# Altium project RIO_rev1.PrjPcb
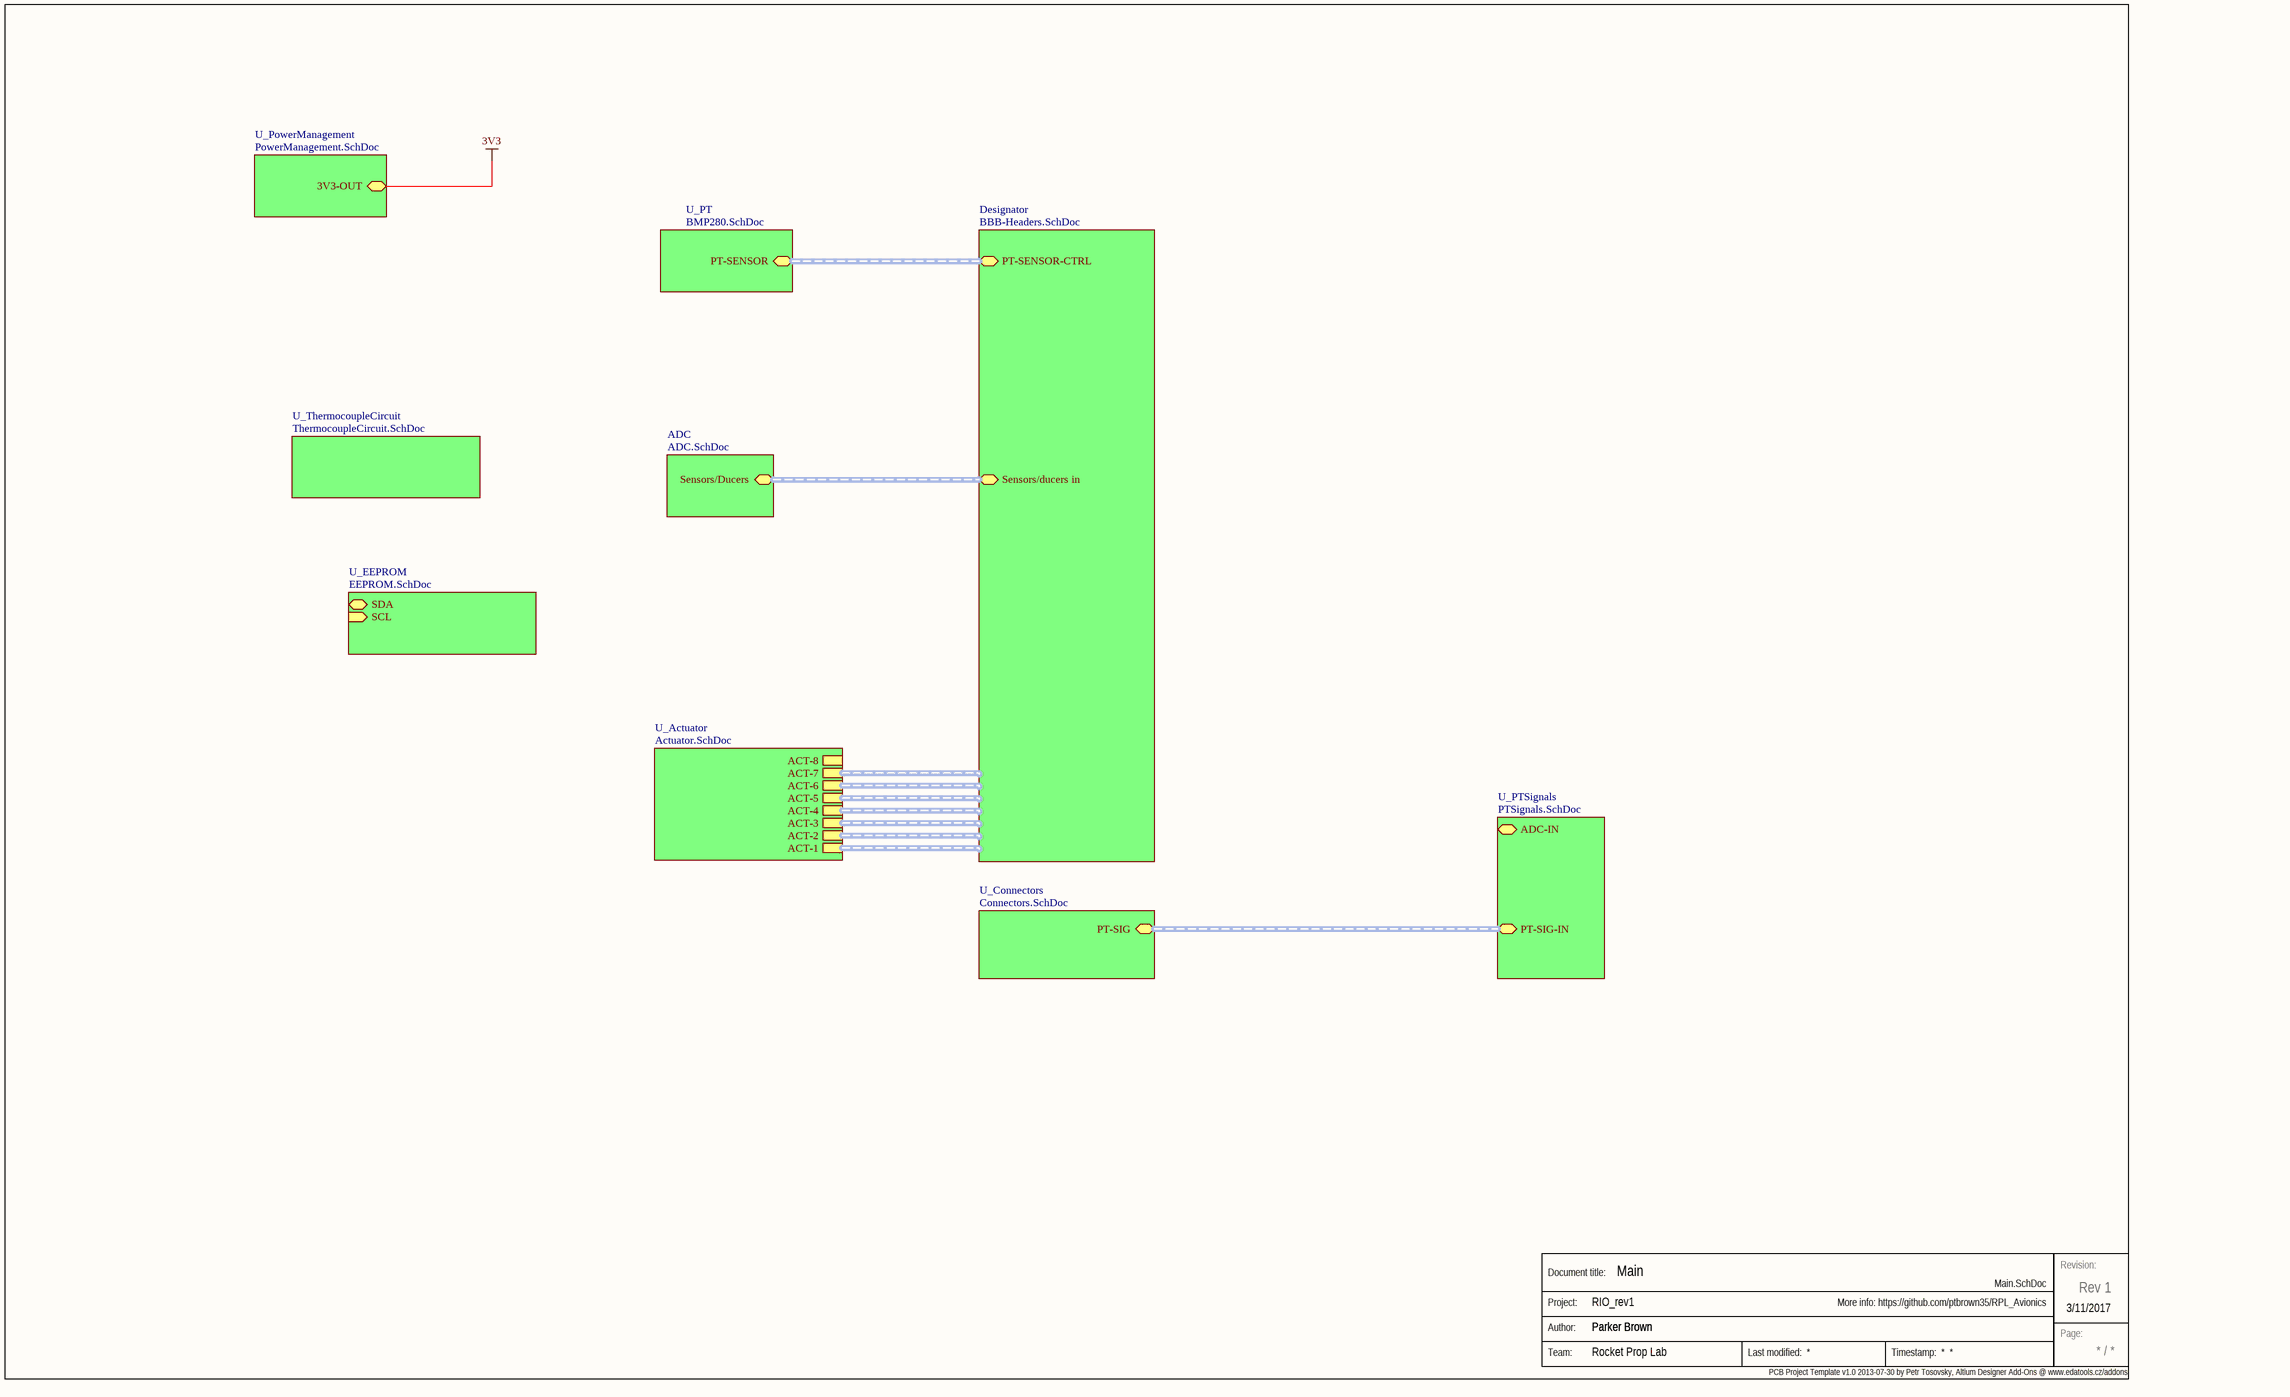
[diagram p0: Main.SchDoc]
GlobalProjectLink: https://github.com/ptbrown35/RPL_Avionics; GlobalProjectName: RIO_rev1; GlobalProjectRevision: Rev 1; GlobalProjectTeam: Rocket Prop Lab; GlobalRevisionDate: 3/11/2017
10 sheets, 85 parts. Net scope: hierarchical (ports join the sheet entries above them; power ports are global).
Board file: RIO_rev1.PcbDoc
Sheets:
  Main.SchDoc
    Designator = BBB-Headers.SchDoc
    U_Connectors = Connectors.SchDoc
      J-PT1 = AnalogConnectors.SchDoc
      J-PT2 = AnalogConnectors.SchDoc
      J-PT3 = AnalogConnectors.SchDoc
      J-PT4 = AnalogConnectors.SchDoc
      J-PT5 = AnalogConnectors.SchDoc
      J-PT6 = AnalogConnectors.SchDoc
      J-PT7 = AnalogConnectors.SchDoc
      J-PT8 = AnalogConnectors.SchDoc
    U_PowerManagement = PowerManagement.SchDoc
    U_PT = BMP280.SchDoc
    U_PTSignals = PTSignals.SchDoc
      U_ADC1 = ADC.SchDoc
      U_ADC2 = ADC.SchDoc
      U_ADC3 = ADC.SchDoc
      U_ADC4 = ADC.SchDoc
      U_ADC5 = ADC.SchDoc
      U_ADC6 = ADC.SchDoc
      U_ADC7 = ADC.SchDoc
      U_ADC8 = ADC.SchDoc
    U_Actuator = Actuator.SchDoc
    ADC = ADC.SchDoc
    U_EEPROM = EEPROM.SchDoc

## Sheet Main.SchDoc: Main
size Tabloid; Author: Parker Brown

### Parts
(Parts that share a designator on the sheet are numbered #1, #2 ... from top to bottom, then left to right.)
Stamp#1  Stamp  (value not drawn)  (graphical)

### Sub-sheets
ADC = ADC.SchDoc: Sensors/Ducers (harness ADC to micro)
Designator = BBB-Headers.SchDoc: PT-SENSOR-CTRL (harness PT-SENSOR), Sensors/ducers in (harness ADC)
U_Actuator = Actuator.SchDoc: ACT-8 (harness ACT), ACT-7 (harness ACT), ACT-6 (harness ACT), ACT-5 (harness ACT), ACT-4 (harness ACT), ACT-3 (harness ACT), ACT-2 (harness ACT), ACT-1 (harness ACT)
U_Connectors = Connectors.SchDoc: PT-SIG (harness PT-SIGNALS)
U_EEPROM = EEPROM.SchDoc: SDA (bidir), SCL (in)
U_PowerManagement = PowerManagement.SchDoc: 3V3-OUT
U_PT = BMP280.SchDoc: PT-SENSOR (harness PT-SENSOR)
U_PTSignals = PTSignals.SchDoc: PT-SIG-IN (harness PT-SIGNALS), ADC-IN (harness ADC)
U_ThermocoupleCircuit = ThermocoupleCircuit.SchDoc (file not in this document): no entries

### Buses and harness runs
harness sheet ADC/Sensors/Ducers = sheet Designator/Sensors/ducers in
harness sheet Designator/PT-SENSOR-CTRL = sheet U_PT/PT-SENSOR
harness sheet U_Connectors/PT-SIG = sheet U_PTSignals/PT-SIG-IN

### Notes on the sheet
- PCB Project Template v1.0 2013-07-30 by Petr Tosovsky, Altium Designer Add-Ons @ www.edatools.cz/addons <http://www.edatools.cz/addons>
- Labels drawn without touching a wire or pin: 3V3
- (in symbol Stamp) Revision:; Document title:; Project:; Author:; Page:; Team:

## Sheet BBB-Headers.SchDoc: Set in Document Options » Parameters » Title
size Tabloid; Author: Set in Document Options » Parameters » Author + Contact info
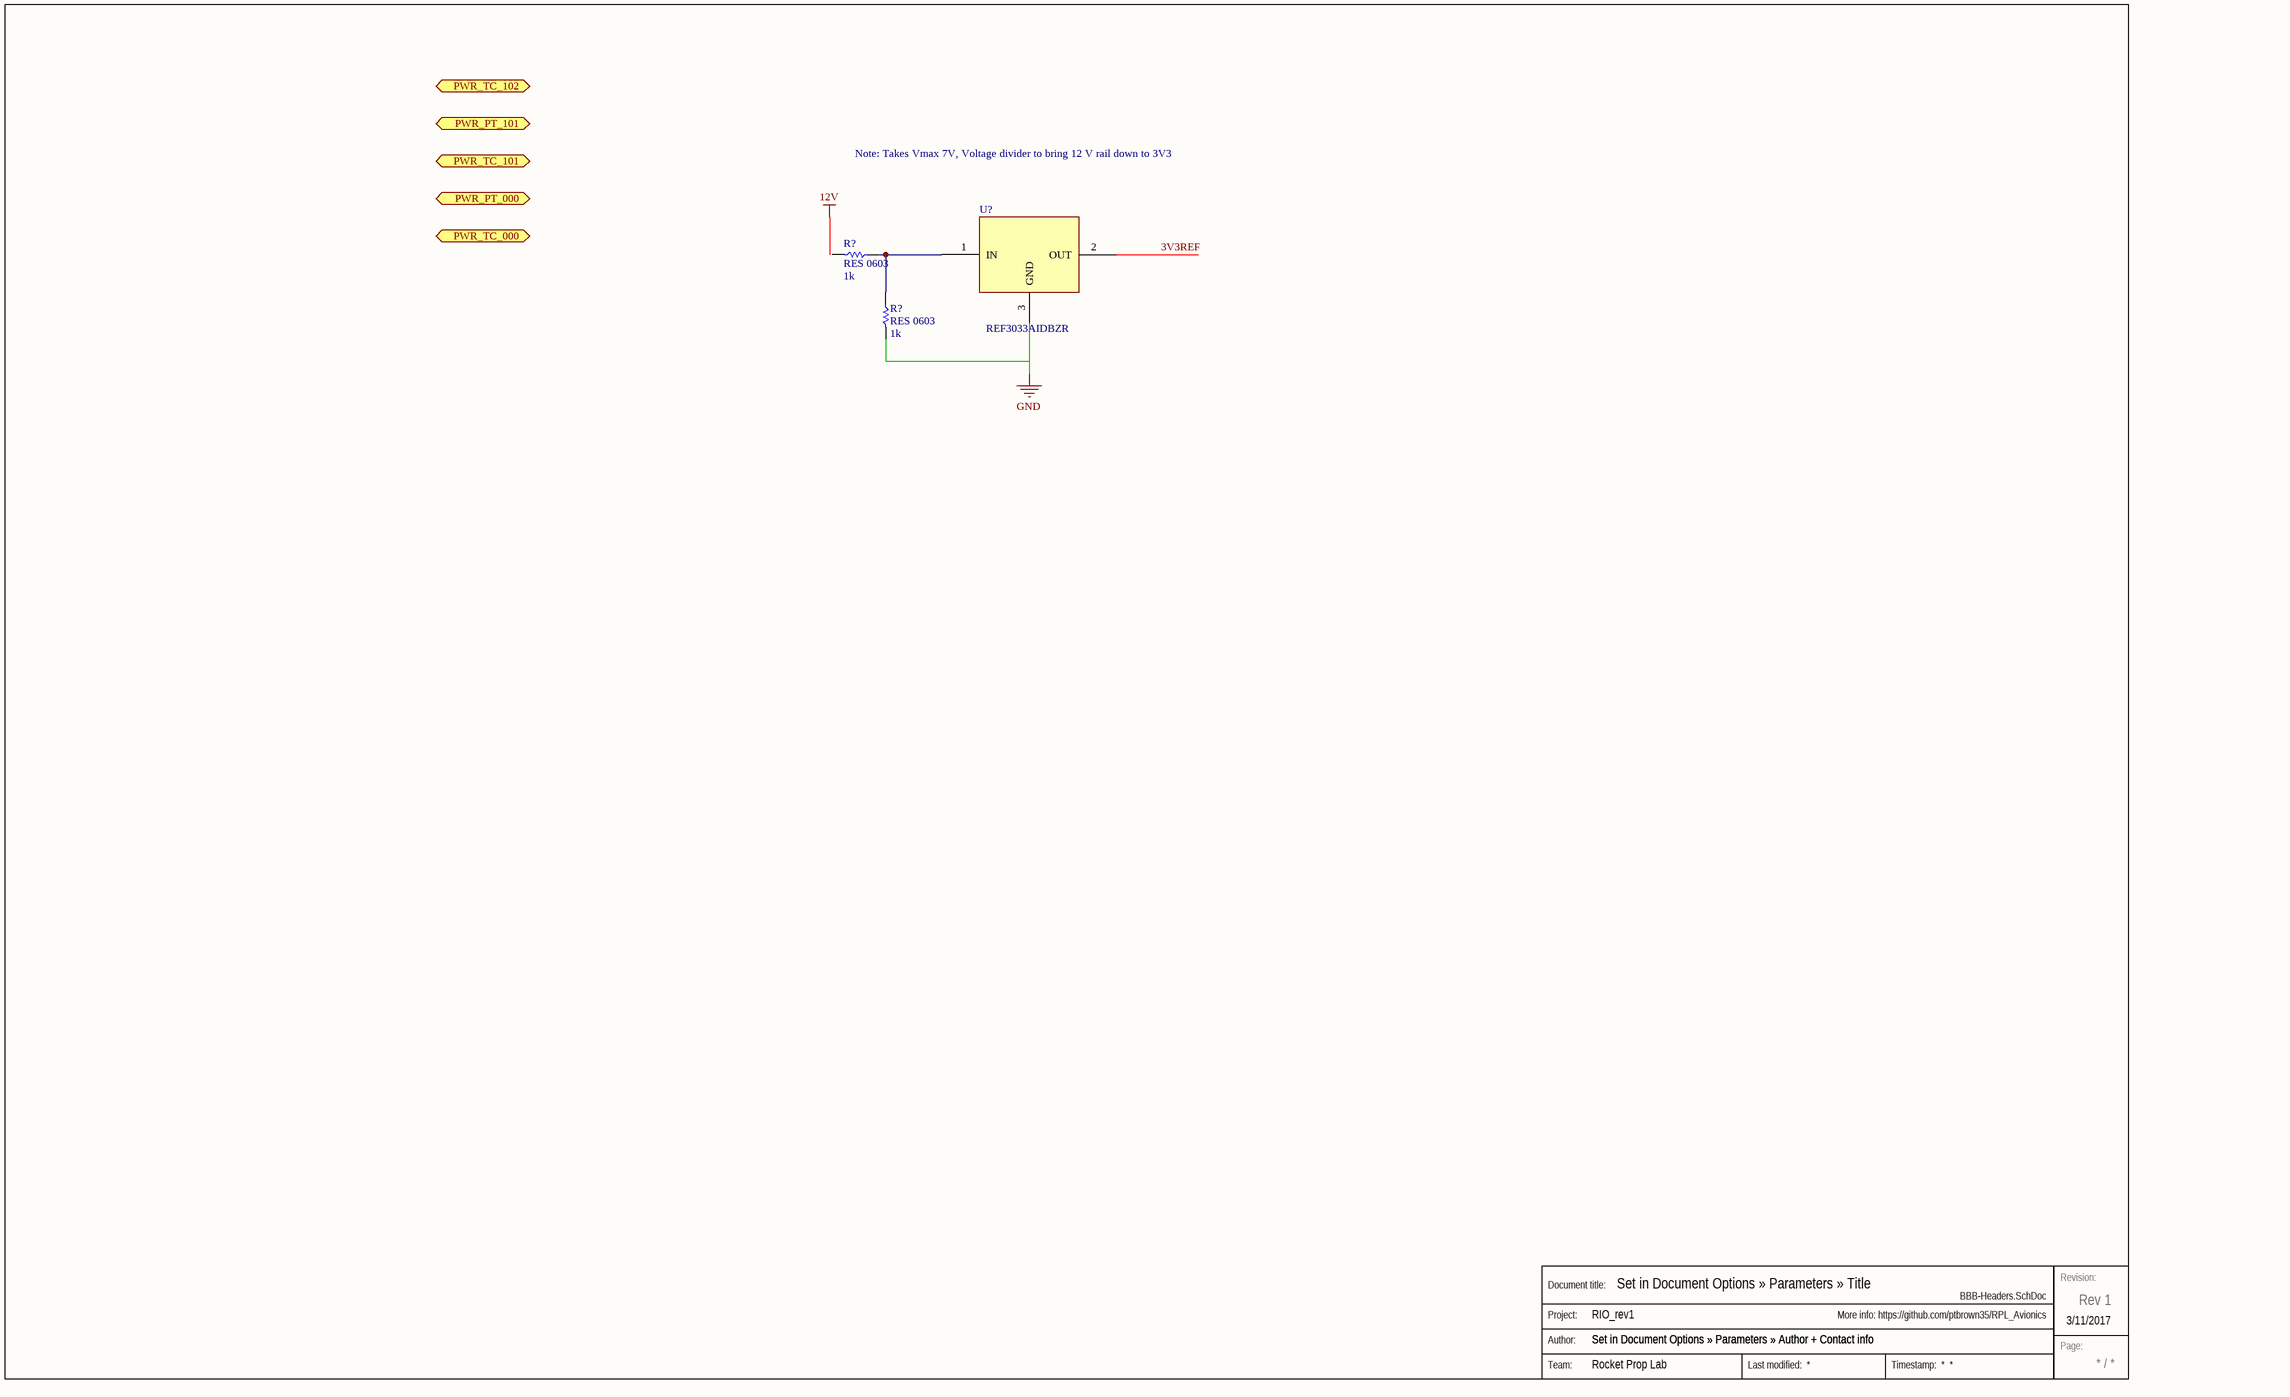
[diagram p1: BBB-Headers.SchDoc]

### Parts
(Parts that share a designator on the sheet are numbered #1, #2 ... from top to bottom, then left to right.)
R?#1  RES 0603  Value (Ohms): 1k  [RES 0603]
R?#2  RES 0603  Value (Ohms): 1k  [RES 0603]
Stamp#2  Stamp  (value not drawn)  (graphical)
U?#1  REF3033AIDBZR  [SOT95P282X145-3N]

### Ports
PWR_PT_000, PWR_PT_101, PWR_TC_000, PWR_TC_101, PWR_TC_102

### Nets
NetR?#1_2: R?#1.2 R?#2.2 U?#1.1(IN)

Not connected (* = marked no-connect by the designer): R?#1 1; R?#2 1; U?#1 2(OUT) 3(GND)

### Buses and harness runs
bus 3V3REF

### Notes on the sheet
- Note: Takes Vmax 7V, Voltage divider to bring 12 V rail down to 3V3
- Labels drawn without touching a wire or pin: 12V, GND
- (in symbol Stamp) Revision:; Document title:; Project:; Author:; Page:; Team:

### Library data of the parts
U?#1 = REF3033AIDBZR: Manufacturer: Texas Instrument; Digikey Link: https://www.digikey.com/product-detail/en/texas-instruments/REF3033AIDBZR/296-26324-1-ND/2254967; Digikey P/N: 296-26324-1-ND; Manufacturer P/N: REF3033AIDBZR
R?#1 R?#2 = RES 0603: PartNumber: *; Tolerance: *

## Sheet Connectors.SchDoc: Set in Document Options » Parameters » Title
size Tabloid; Author: Set in Document Options » Parameters » Author + Contact info
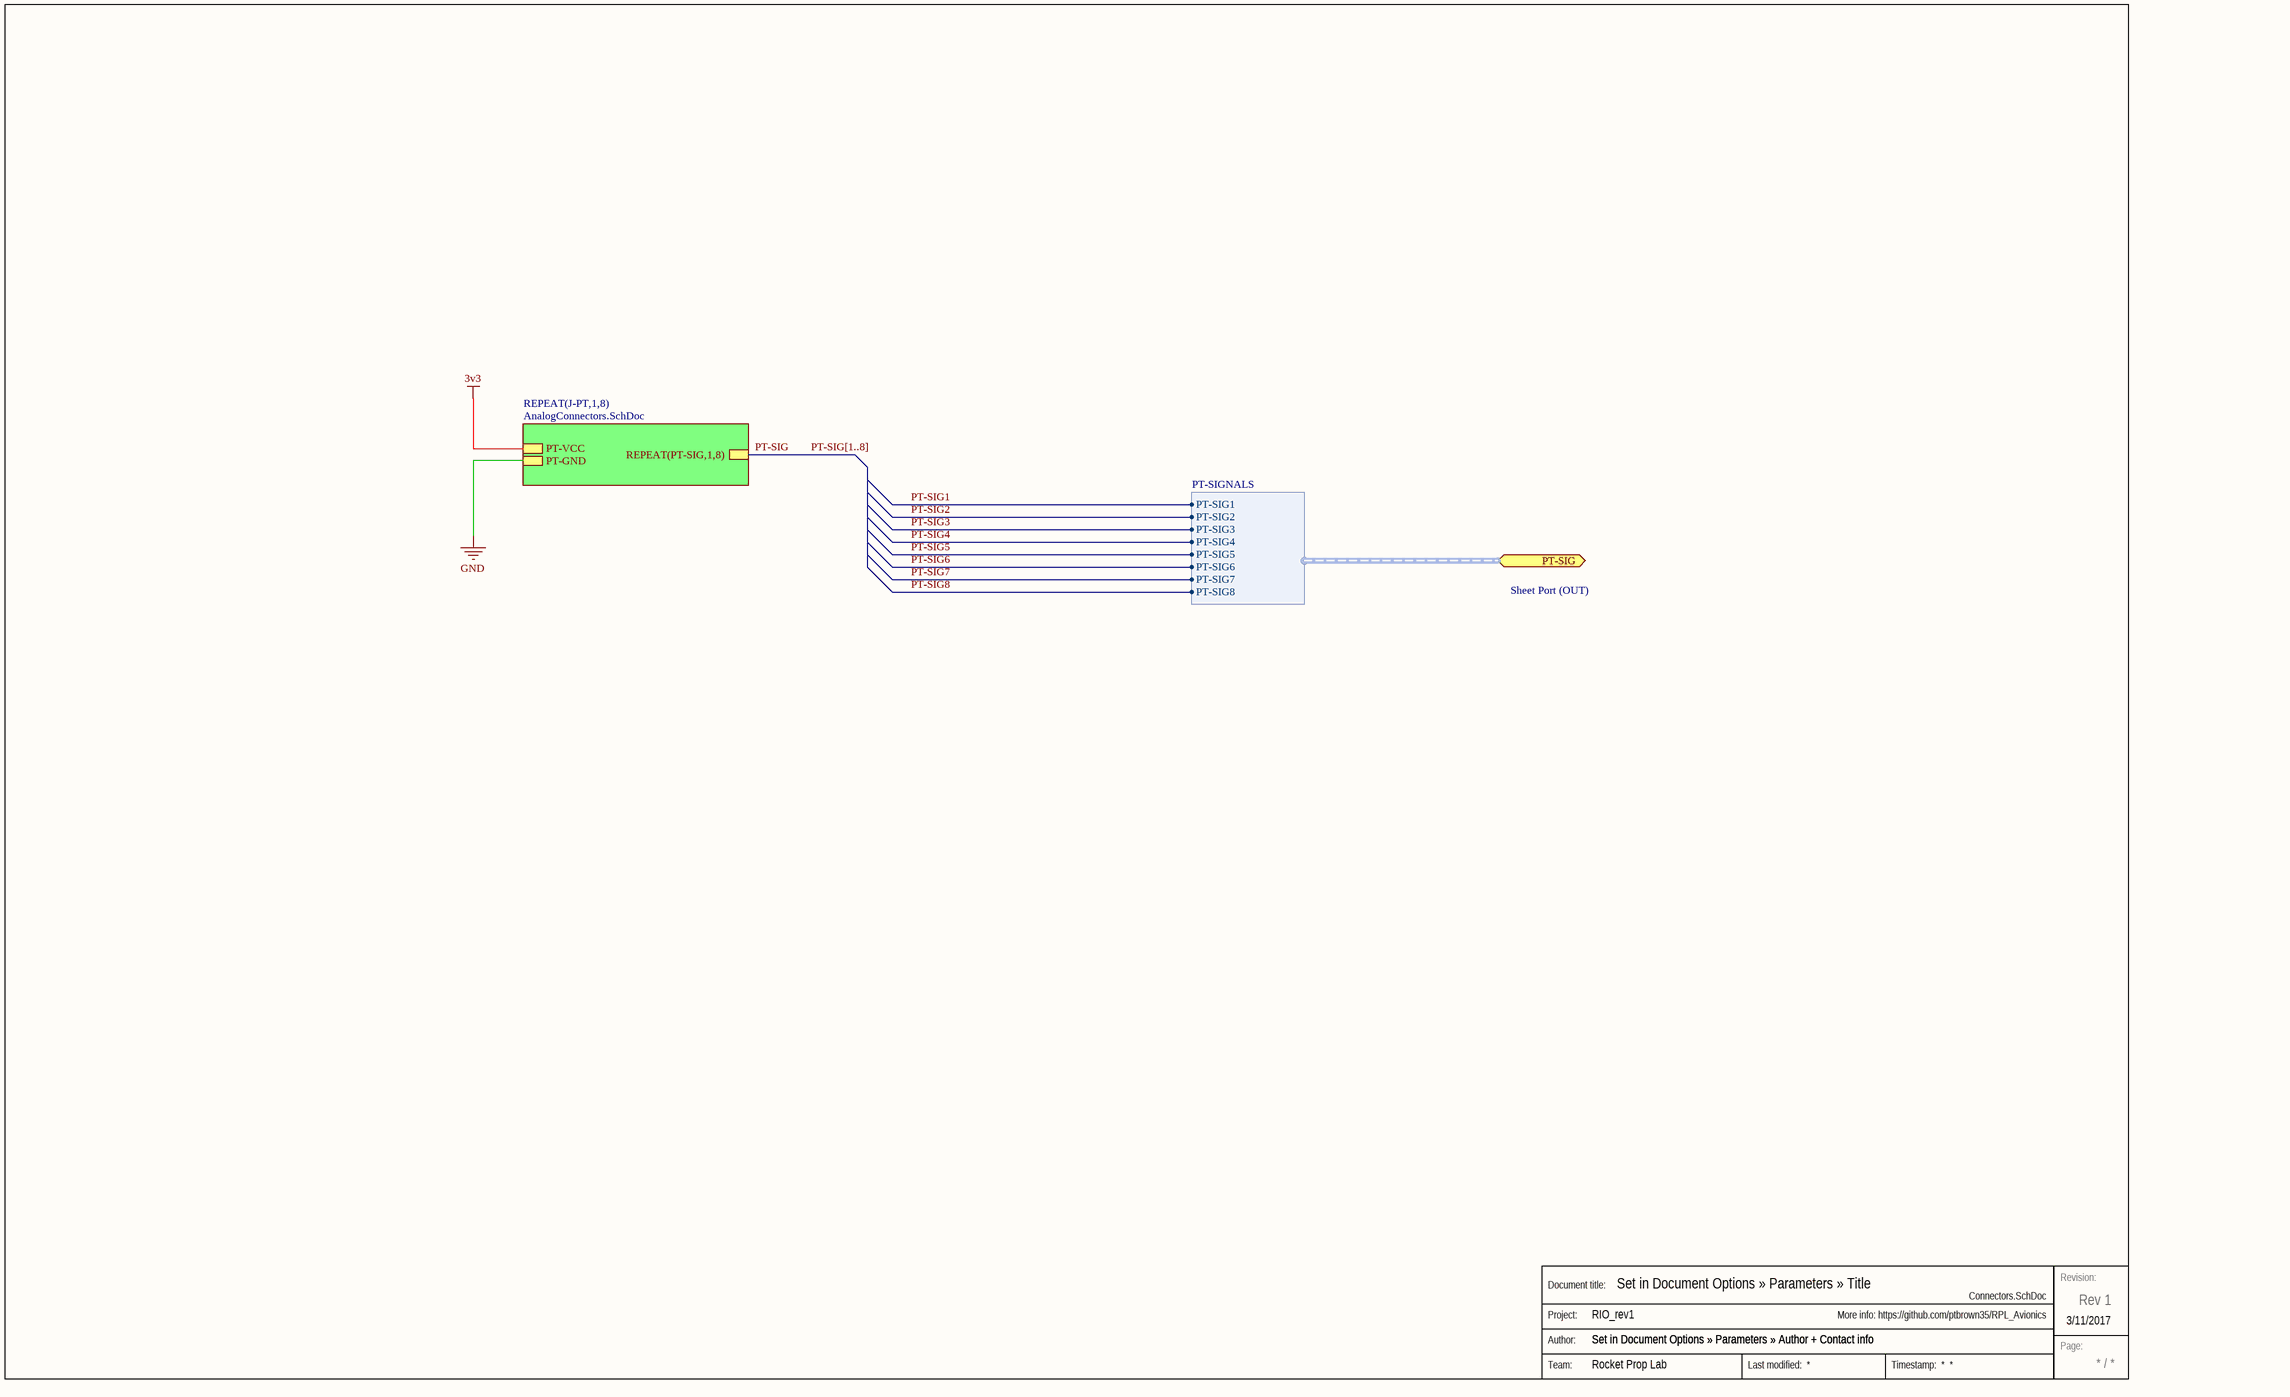
[diagram p2: Connectors.SchDoc]

### Parts
(Parts that share a designator on the sheet are numbered #1, #2 ... from top to bottom, then left to right.)
Stamp#3  Stamp  (value not drawn)  (graphical)

### Sub-sheets
REPEAT(J-PT,1,8) = AnalogConnectors.SchDoc: PT-VCC, REPEAT(PT-SIG,1,8), PT-GND

### Ports
PT-SIG (harness PT-SIGNALS)

### Harnesses
PT-SIGNALS: PT-SIG1, PT-SIG2, PT-SIG3, PT-SIG4, PT-SIG5, PT-SIG6, PT-SIG7, PT-SIG8

### Buses and harness runs
bus PT-SIG[1..8]

### Notes on the sheet
- Sheet Port (OUT)
- (in symbol Stamp) Revision:; Document title:; Project:; Author:; Page:; Team:

## Sheet AnalogConnectors.SchDoc: Set in Document Options » Parameters » Title
size Tabloid; Author: Set in Document Options » Parameters » Author + Contact info
Used 8 times, as channels U_Connectors/J-PT1, U_Connectors/J-PT2, U_Connectors/J-PT3, U_Connectors/J-PT4, U_Connectors/J-PT5, U_Connectors/J-PT6, U_Connectors/J-PT7, U_Connectors/J-PT8. Parts and nets are listed once, with the designators drawn on the sheet.
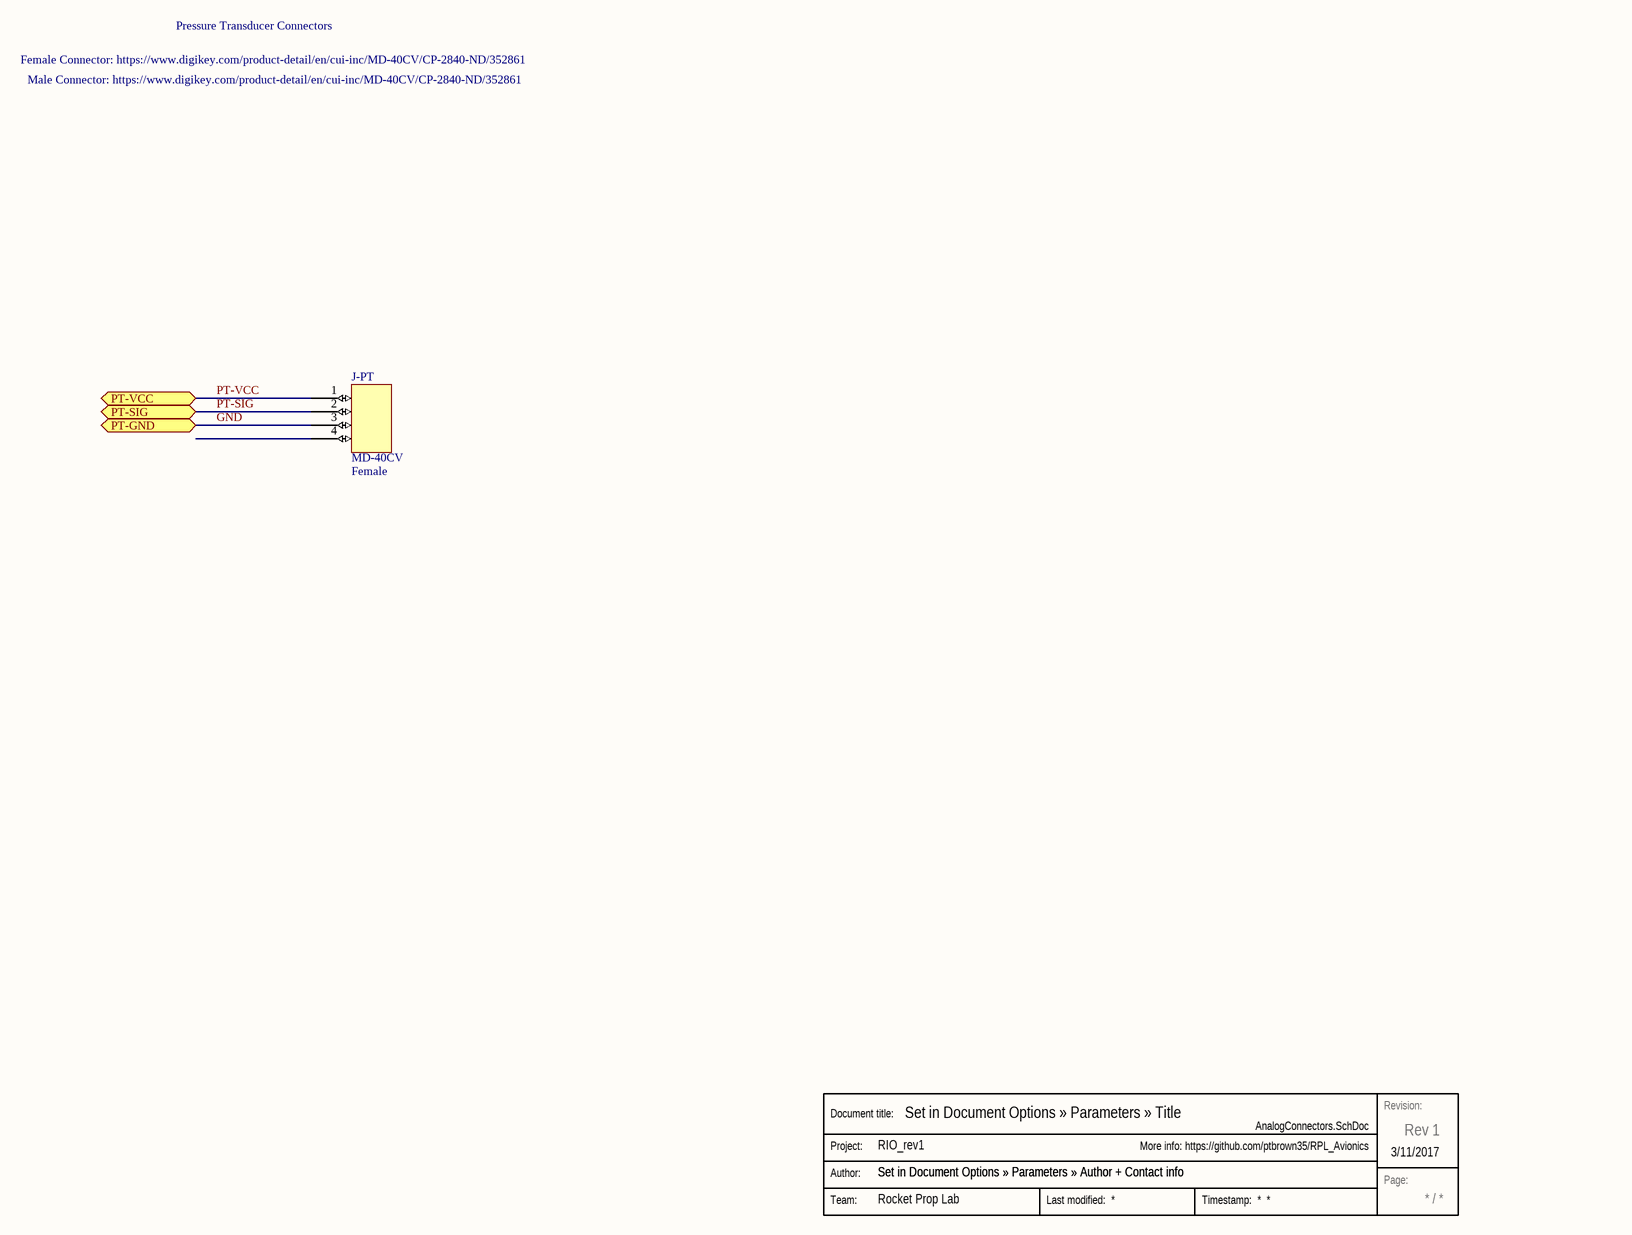
[diagram p3: AnalogConnectors.SchDoc]

### Parts
J-PT  Gender: Female  (hidden comment: MD-40CV)
Stamp  Stamp  (value not drawn)  (graphical)

### Ports
PT-GND, PT-SIG, PT-VCC

### Nets
GND: J-PT.3 ; port PT-GND
PT-SIG: J-PT.2 ; port PT-SIG
PT-VCC: J-PT.1 ; port PT-VCC

Not connected (* = marked no-connect by the designer): J-PT 4

### Channels
U_Connectors/J-PT1: designators end in _J-PT1; ports PT-GND=GND PT-SIG=PT-SIG PT-VCC=PT-VCC
U_Connectors/J-PT2: designators end in _J-PT2; ports PT-GND=GND PT-SIG=PT-SIG PT-VCC=PT-VCC
U_Connectors/J-PT3: designators end in _J-PT3; ports PT-GND=GND PT-SIG=PT-SIG PT-VCC=PT-VCC
U_Connectors/J-PT4: designators end in _J-PT4; ports PT-GND=GND PT-SIG=PT-SIG PT-VCC=PT-VCC
U_Connectors/J-PT5: designators end in _J-PT5; ports PT-GND=GND PT-SIG=PT-SIG PT-VCC=PT-VCC
U_Connectors/J-PT6: designators end in _J-PT6; ports PT-GND=GND PT-SIG=PT-SIG PT-VCC=PT-VCC
U_Connectors/J-PT7: designators end in _J-PT7; ports PT-GND=GND PT-SIG=PT-SIG PT-VCC=PT-VCC
U_Connectors/J-PT8: designators end in _J-PT8; ports PT-GND=GND PT-SIG=PT-SIG PT-VCC=PT-VCC

### Notes on the sheet
- Pressure Transducer Connectors
- Female Connector: https://www.digikey.com/product-detail/en/cui-inc/MD-40CV/CP-2840-ND/352861
- Male Connector: https://www.digikey.com/product-detail/en/cui-inc/MD-40CV/CP-2840-ND/352861
- (in symbol Stamp) Revision:; Document title:; Project:; Author:; Page:; Team:

### Library data of the parts
J-PT = MD-40CV: Manufacturer: CUI, Inc.; Digikey Link: https://www.digikey.com/product-detail/en/cui-inc/MD-40CV/CP-2840-ND/352861; Digikey P/N: CP-2840-ND; Manufacturer P/N: MD-40CV

## Sheet PowerManagement.SchDoc: Set in Document Options » Parameters » Title
size Tabloid; Author: Set in Document Options » Parameters » Author + Contact info
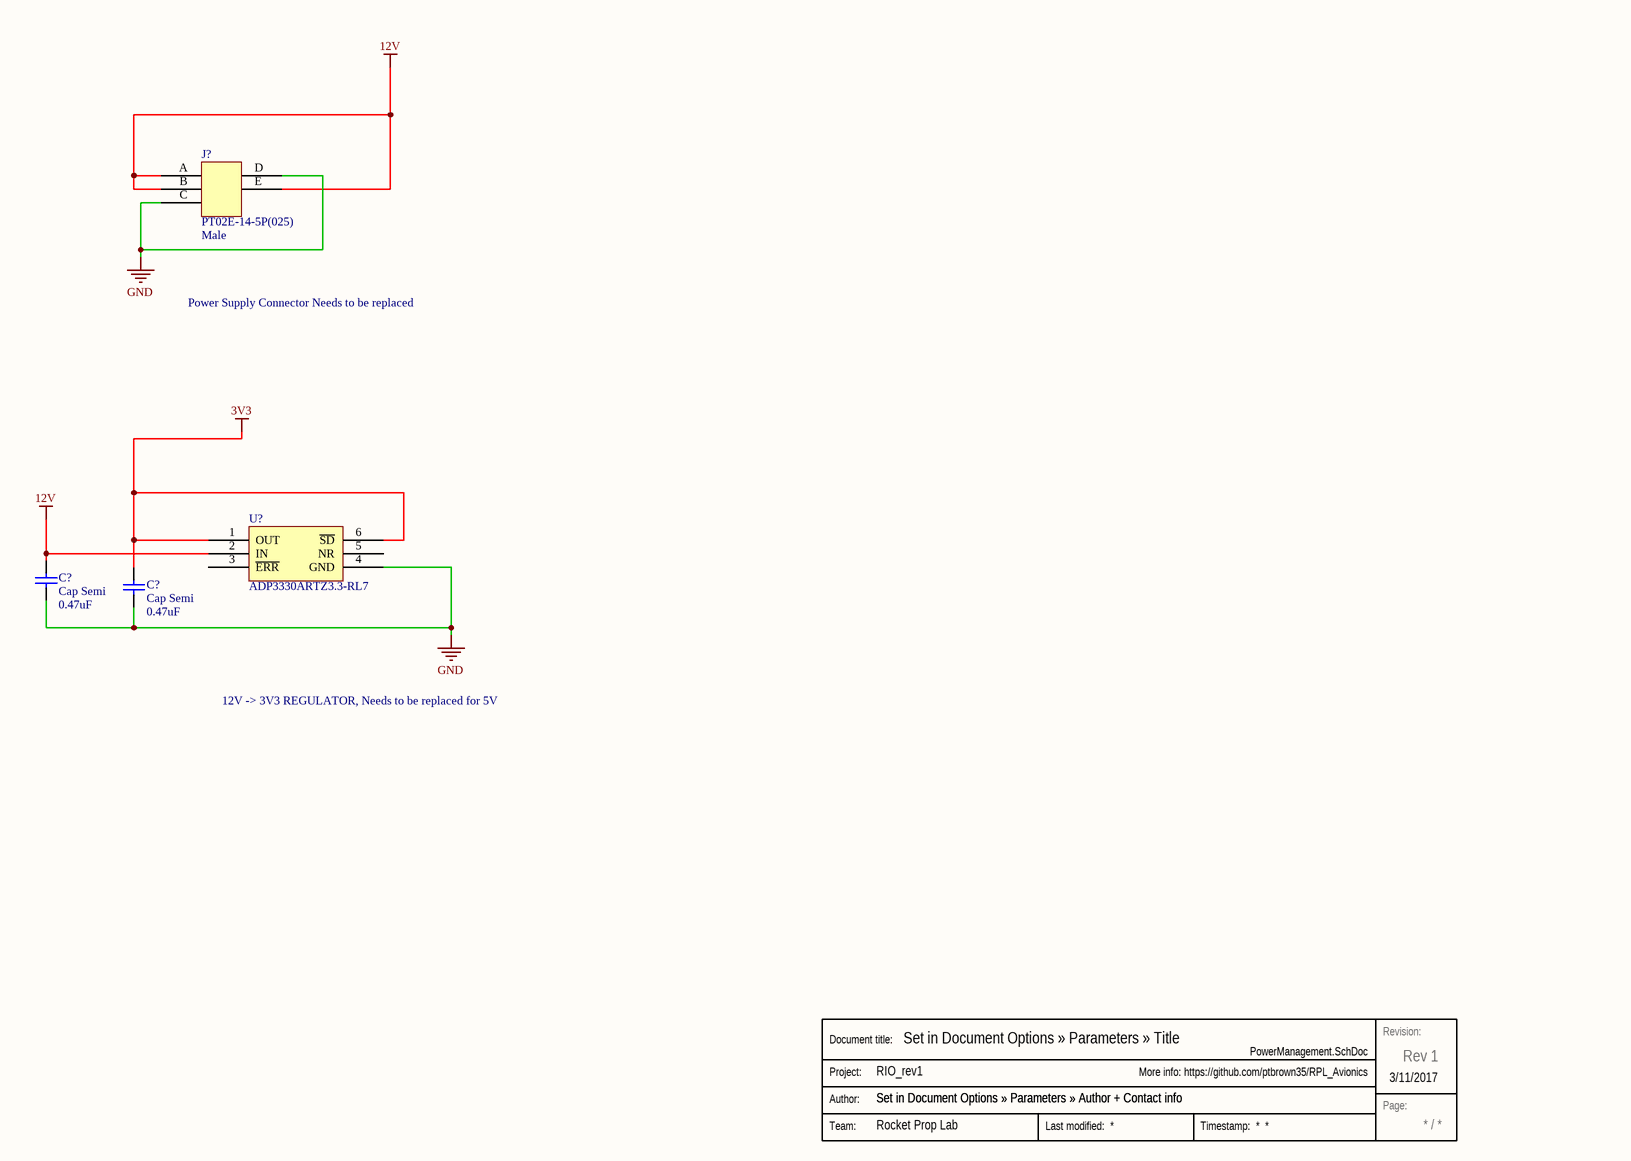
[diagram p4: PowerManagement.SchDoc]

### Parts
(Parts that share a designator on the sheet are numbered #1, #2 ... from top to bottom, then left to right.)
C?#1  Cap Semi  value 0.47uF  [0402]
C?#2  Cap Semi  value 0.47uF  [0402]
J?  Gender: Male  (hidden comment: PT02E-14-5P(025))
Stamp#4  Stamp  (value not drawn)  (graphical)
U?#2  ADP3330ARTZ3.3-RL7

### Nets
3V3: C?#2.2 U?#2.1(OUT) U?#2.6(~{SD})  [project net PT-VCC]
12V: C?#1.2 J?.A J?.B J?.E U?#2.2(IN)
GND: C?#1.1 C?#2.1 J?.C J?.D U?#2.4(GND)

Not connected (* = marked no-connect by the designer): U?#2 3(~{ERR}) 5(NR)

### Notes on the sheet
- Power Supply Connector Needs to be replaced
- 12V -> 3V3 REGULATOR, Needs to be replaced for 5V
- (in symbol Stamp) Revision:; Document title:; Project:; Author:; Page:; Team:

### Library data of the parts
C?#1 C?#2 = Cap Semi: Capacitor (Semiconductor SIM Model); Published: 8-Jun-2000; LatestRevisionDate: 29-May-2009; LatestRevisionNote: IPC-7351 Footprint Added.; PackageReference: C1206; Publisher: Altium Limited; PackageDescription: Chip Capacitor
J? = PT02E-14-5P(025): Manufacturer: Amphenol Industrial Operations; Digikey P/N: PT02E-14-5P(025)-ND; Digikey Link: https://www.digikey.com/product-detail/en/amphenol-industrial-operations/PT02E-14-5P(025)/PT02E-14-5P(025)-ND/1209810; Manufacturer P/N: PT02E-14-5P(025)
U?#2 = ADP3330ARTZ3.3-RL7: Manufacturer: Analog Devices; Digikey P/N: ADP3330ARTZ3.3-RL7DKR-ND; Digikey Link: https://www.digikey.com/product-detail/en/analog-devices-inc/ADP3330ARTZ3.3-RL7/ADP3330ARTZ3.3-RL7DKR-ND/1788602; Manufacturer P/N: ADP3330ARTZ3.3-RL7

## Sheet BMP280.SchDoc: Onboard Pressure/Temperature Sensor
size Tabloid; Author: Set in Document Options » Parameters » Author + Contact info
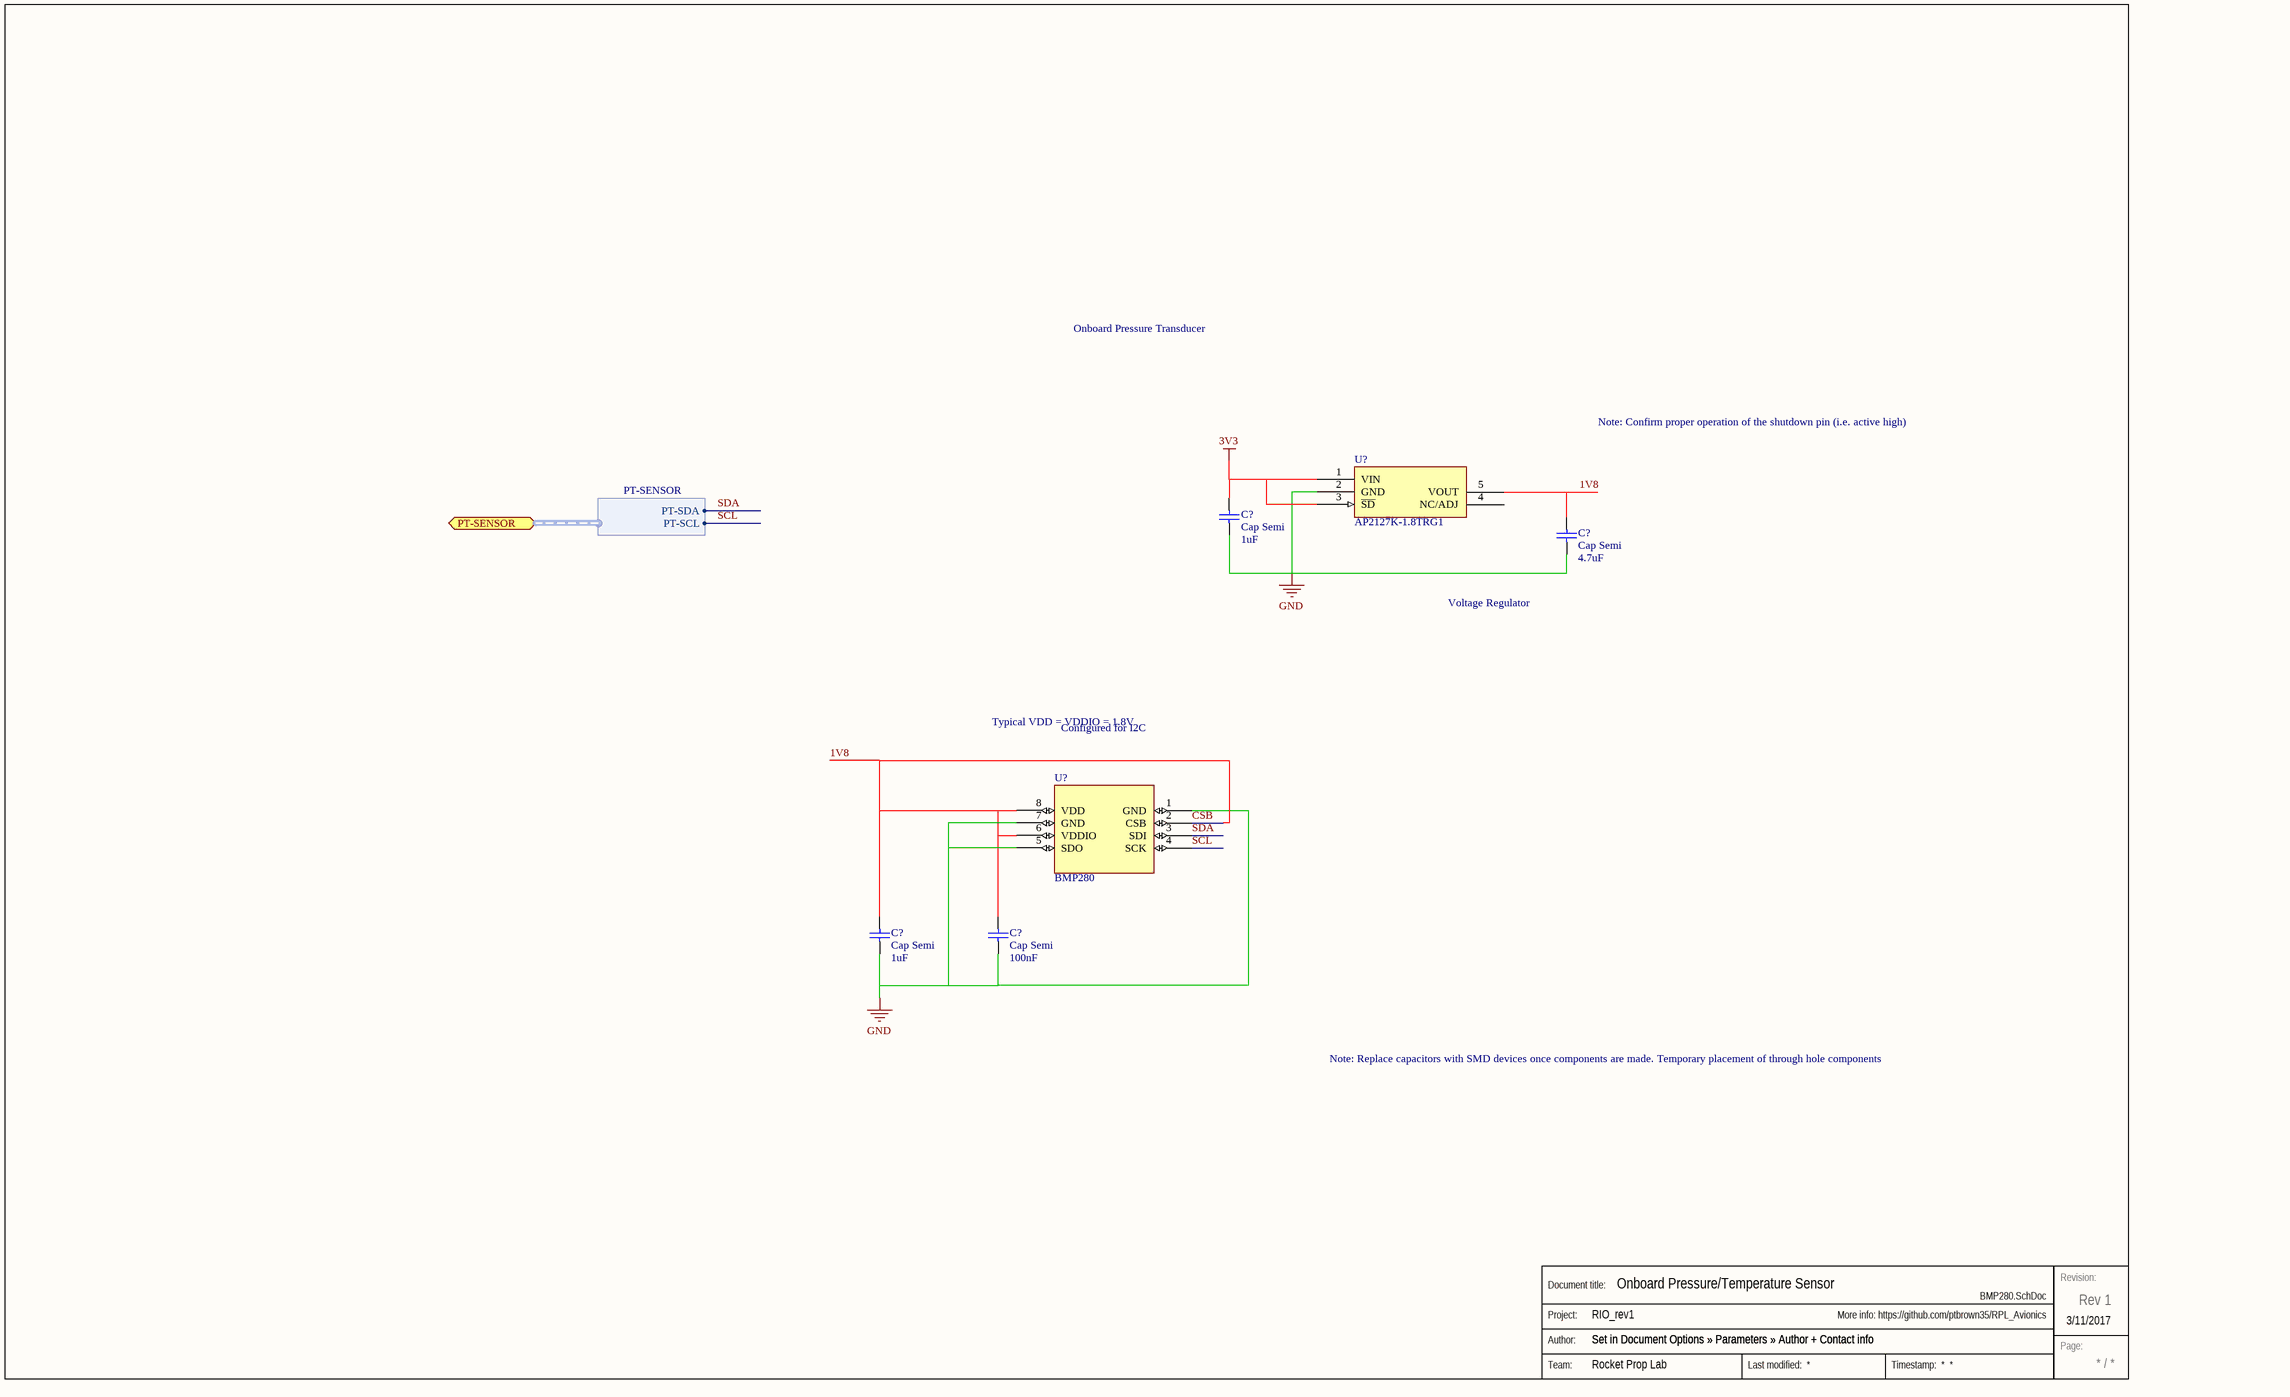
[diagram p5: BMP280.SchDoc]

### Parts
(Parts that share a designator on the sheet are numbered #1, #2 ... from top to bottom, then left to right.)
C?#3  Cap Semi  value 1uF  [0402]
C?#4  Cap Semi  value 4.7uF  [0402]
C?#5  Cap Semi  value 1uF  [0402]
C?#6  Cap Semi  value 100nF  [0402]
Stamp#5  Stamp  (value not drawn)  (graphical)
U?#3  AP2127  [SOT95P240X110-3N]  (value not drawn)
U?#4  BMP280  [LGA-8_BMP280(Primary)]

### Ports
PT-SENSOR (harness PT-SENSOR)

### Harnesses
PT-SENSOR: PT-SCL, PT-SDA

### Nets
CSB: U?#4.2(CSB)
SCL: U?#4.4(SCK) ; port PT-SENSOR.PT-SCL
SDA: U?#4.3(SDI) ; port PT-SENSOR.PT-SDA

Not connected (* = marked no-connect by the designer): C?#3 1 2; C?#4 1 2; C?#5 1 2; C?#6 1 2; U?#3 1(VIN) 2(GND) 3(~{SD}) 4(NC/ADJ) 5(VOUT); U?#4 1(GND) 5(SDO) 6(VDDIO) 7(GND) 8(VDD)

### Buses and harness runs
bus 1V8

### Notes on the sheet
- Onboard Pressure Transducer
- Note: Confirm proper operation of the shutdown pin (i.e. active high)
- Voltage Regulator
- Typical VDD = VDDIO = 1.8V
- Configured for I2C
- Note: Replace capacitors with SMD devices once components are made. Temporary placement of through hole components
- Labels drawn without touching a wire or pin: 3V3, GND
- (in symbol Stamp) Revision:; Document title:; Project:; Author:; Page:; Team:

### Library data of the parts
C?#3-C?#6 = Cap Semi: Capacitor (Semiconductor SIM Model); Published: 8-Jun-2000; LatestRevisionDate: 29-May-2009; LatestRevisionNote: IPC-7351 Footprint Added.; PackageReference: C1206; Publisher: Altium Limited; PackageDescription: Chip Capacitor
U?#3 = AP2127: AP2127K-1.8TRG1; Manufacturer: Diodes Incorporated; Digikey Link: https://www.digikey.com/product-detail/en/diodes-incorporated/AP2127K-1.8TRG1/AP2127K-1.8TRG1DICT-ND/4505274; Digikey P/N: AP2127K-1.8TRG1DICT-ND; Footprint: SOT-23-5; Manufacturer P/N: AP2127K-1.8TRG1
U?#4 = BMP280: BMP280 Absolute Barometric Pressure Sensor for Battery Powered Devices 2 x 2.5mm; MF: Bosch; Availability: Good; MP: BMP280; Price: 2.16 USD; Package: None; Value: *

## Sheet PTSignals.SchDoc: Set in Document Options » Parameters » Title
size Tabloid; Author: Set in Document Options » Parameters » Author + Contact info
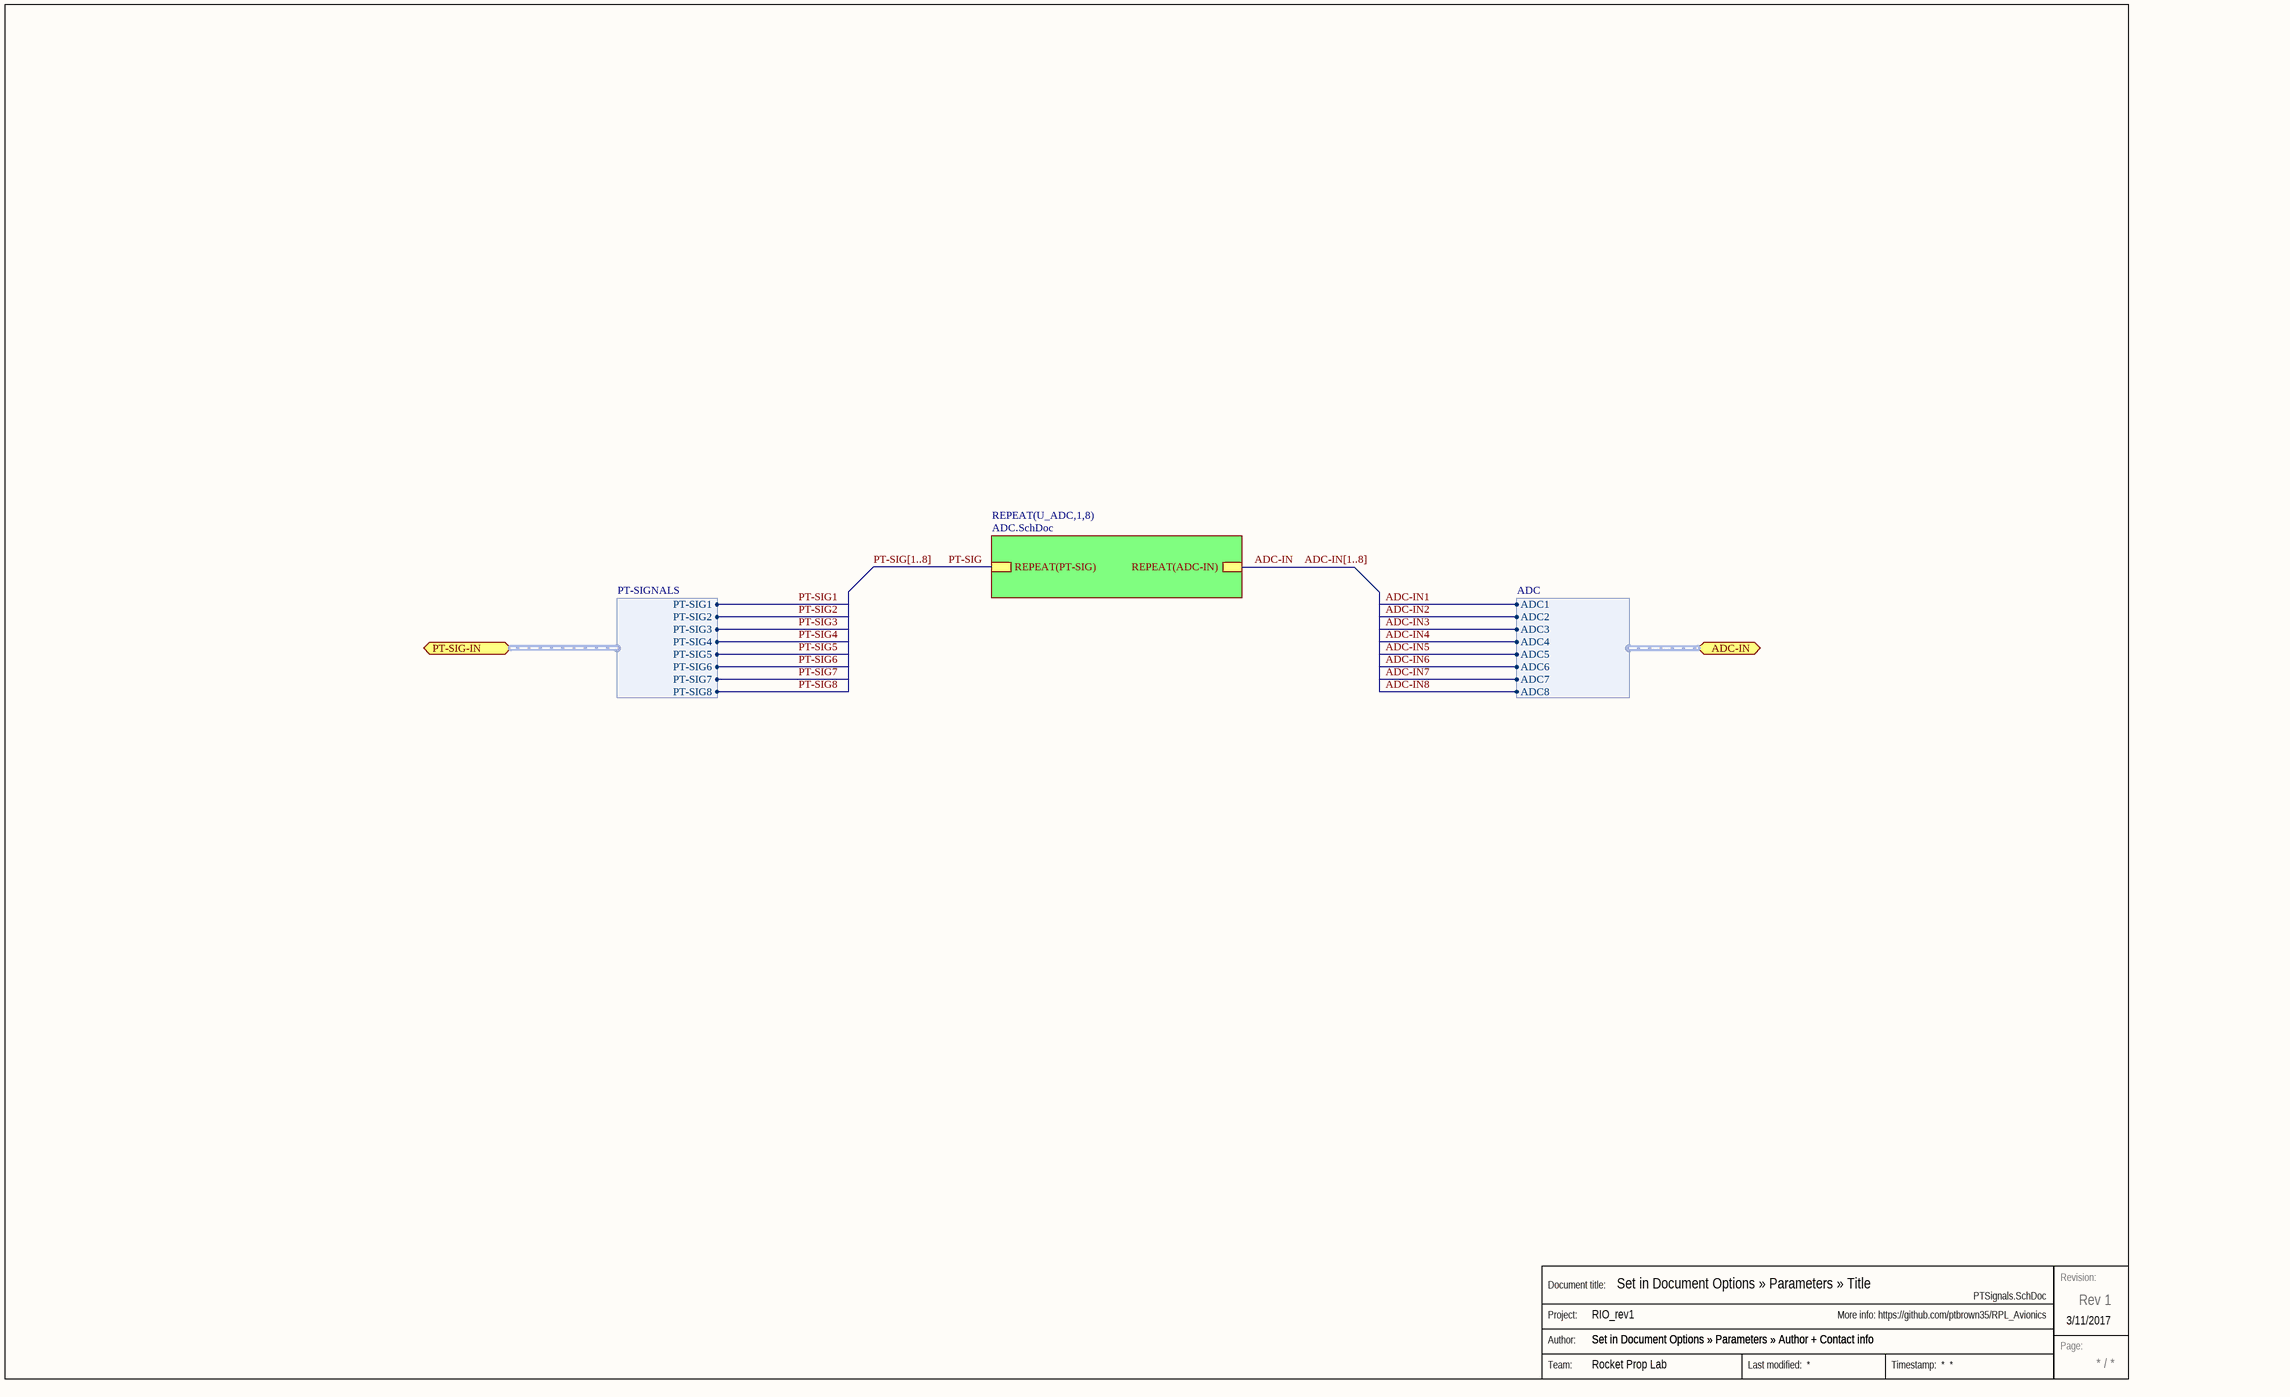
[diagram p6: PTSignals.SchDoc]

### Parts
(Parts that share a designator on the sheet are numbered #1, #2 ... from top to bottom, then left to right.)
Stamp#6  Stamp  (value not drawn)  (graphical)

### Sub-sheets
REPEAT(U_ADC,1,8) = ADC.SchDoc: REPEAT(PT-SIG), REPEAT(ADC-IN)

### Ports
ADC-IN (harness ADC), PT-SIG-IN (harness PT-SIGNALS)

### Harnesses
ADC: ADC1, ADC2, ADC3, ADC4, ADC5, ADC6, ADC7, ADC8
PT-SIGNALS: PT-SIG1, PT-SIG2, PT-SIG3, PT-SIG4, PT-SIG5, PT-SIG6, PT-SIG7, PT-SIG8

### Buses and harness runs
bus ADC-IN[1..8]
bus PT-SIG[1..8]

### Notes on the sheet
- (in symbol Stamp) Revision:; Document title:; Project:; Author:; Page:; Team:

## Sheet ADC.SchDoc: Set in Document Options » Parameters » Title
size Tabloid; Author: Set in Document Options » Parameters » Author + Contact info
Used 9 times, as channels U_PTSignals/U_ADC1, U_PTSignals/U_ADC2, U_PTSignals/U_ADC3, U_PTSignals/U_ADC4, U_PTSignals/U_ADC5, U_PTSignals/U_ADC6, U_PTSignals/U_ADC7, U_PTSignals/U_ADC8, ADC. Parts and nets are listed once, with the designators drawn on the sheet.
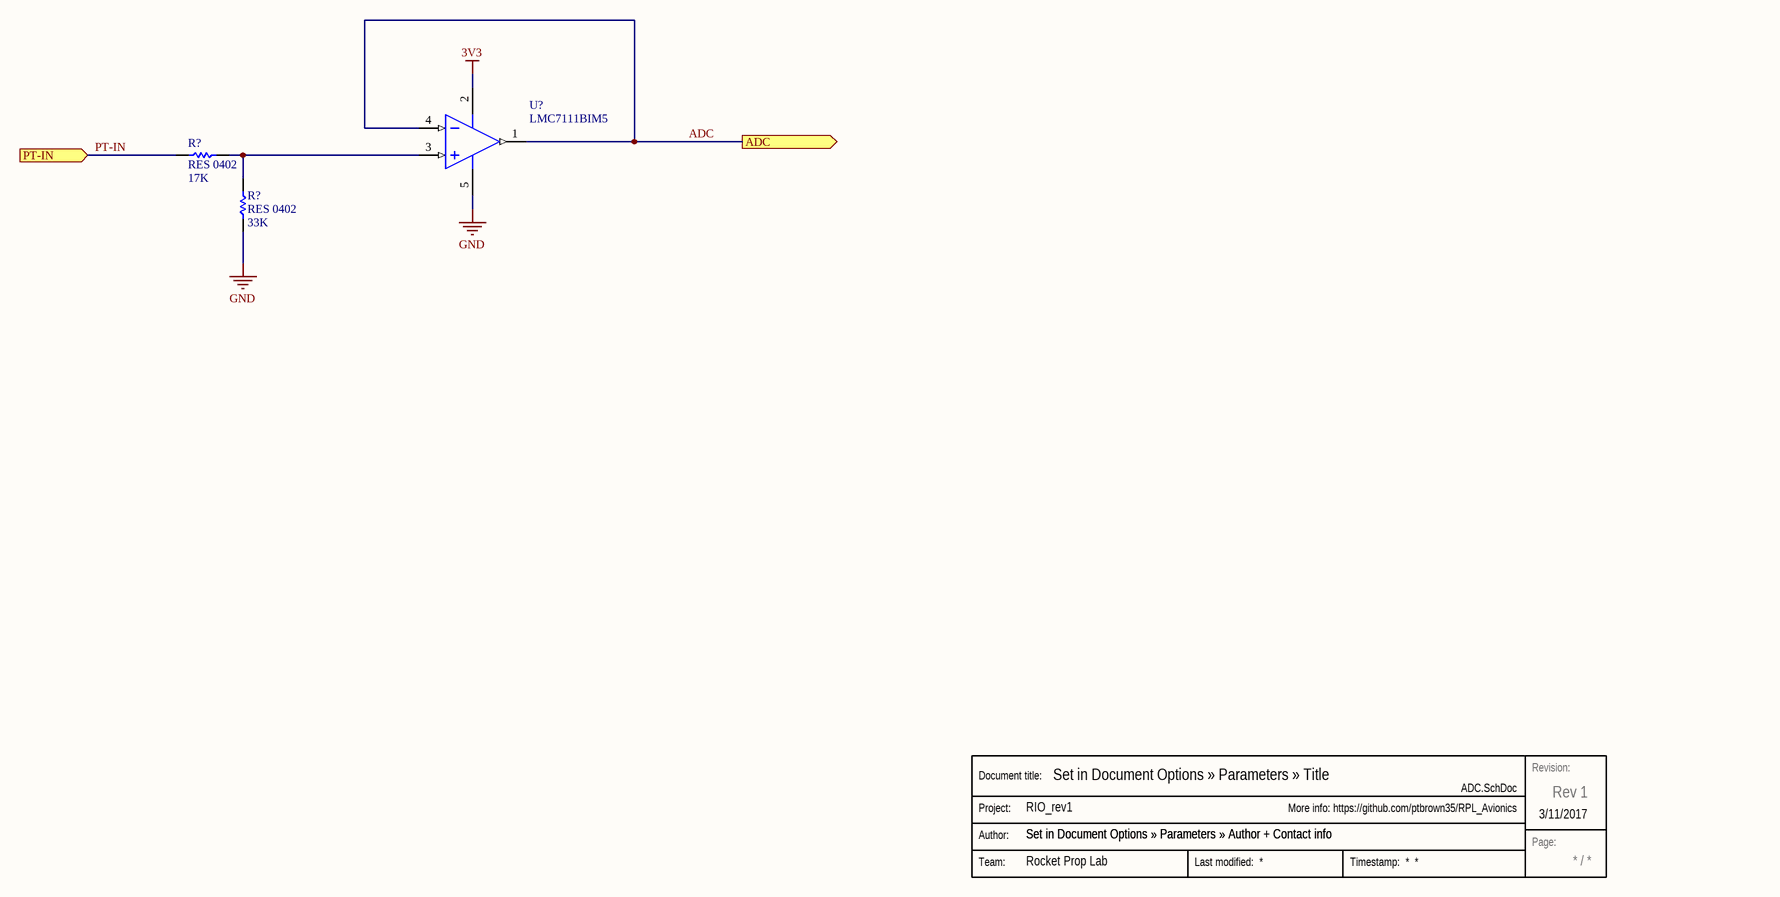
[diagram p7: ADC.SchDoc]

### Parts
(Parts that share a designator on the sheet are numbered #1, #2 ... from top to bottom, then left to right.)
R?#1  RES 0402  Value (Ohms): 17K  [RES 0402]
R?#2  RES 0402  Value (Ohms): 33K  [RES 0402]
Stamp  Stamp  (value not drawn)  (graphical)
U?  LMC7111BIM5  [MF05A_N]

### Ports
ADC (out), PT-IN (in)

### Nets
3V3: U?.2(V+)
GND: R?#2.1 U?.5(V-)
ADC: U?.1(OUT) U?.4(IN-) ; port ADC
PT-IN: R?#1.1 ; port PT-IN
NetR?#1_2: R?#1.2 R?#2.2 U?.3(IN+)

### Channels
U_PTSignals/U_ADC1: designators R?=R?_U_ADC1#1 R?=R?_U_ADC1#2 Stamp=Stamp_U_ADC1 U?=U?_U_ADC1; ports ADC=ADC_U_ADC1 PT-IN=PT-IN_U_ADC1
U_PTSignals/U_ADC2: designators R?=R?_U_ADC2#1 R?=R?_U_ADC2#2 Stamp=Stamp_U_ADC2 U?=U?_U_ADC2; ports ADC=ADC_U_ADC2 PT-IN=PT-IN_U_ADC2
U_PTSignals/U_ADC3: designators R?=R?_U_ADC3#1 R?=R?_U_ADC3#2 Stamp=Stamp_U_ADC3 U?=U?_U_ADC3; ports ADC=ADC_U_ADC3 PT-IN=PT-IN_U_ADC3
U_PTSignals/U_ADC4: designators R?=R?_U_ADC4#1 R?=R?_U_ADC4#2 Stamp=Stamp_U_ADC4 U?=U?_U_ADC4; ports ADC=ADC_U_ADC4 PT-IN=PT-IN_U_ADC4
U_PTSignals/U_ADC5: designators R?=R?_U_ADC5#1 R?=R?_U_ADC5#2 Stamp=Stamp_U_ADC5 U?=U?_U_ADC5; ports ADC=ADC_U_ADC5 PT-IN=PT-IN_U_ADC5
U_PTSignals/U_ADC6: designators R?=R?_U_ADC6#1 R?=R?_U_ADC6#2 Stamp=Stamp_U_ADC6 U?=U?_U_ADC6; ports ADC=ADC_U_ADC6 PT-IN=PT-IN_U_ADC6
U_PTSignals/U_ADC7: designators R?=R?_U_ADC7#1 R?=R?_U_ADC7#2 Stamp=Stamp_U_ADC7 U?=U?_U_ADC7; ports ADC=ADC_U_ADC7 PT-IN=PT-IN_U_ADC7
U_PTSignals/U_ADC8: designators R?=R?_U_ADC8#1 R?=R?_U_ADC8#2 Stamp=Stamp_U_ADC8 U?=U?_U_ADC8; ports ADC=ADC_U_ADC8 PT-IN=PT-IN_U_ADC8
ADC: designators R?=R?_ADC#1 R?=R?_ADC#2 Stamp=Stamp_ADC U?=U?_ADC; ports ADC=ADC_ADC PT-IN=PT-IN_ADC

### Notes on the sheet
- (in symbol Stamp) Revision:; Document title:; Project:; Author:; Page:; Team:

### Library data of the parts
U? = LMC7111BIM5: Tiny CMOS Operational Amplifier with Rail-to-Rail Input and Output, 5-pin SOT-23; Manufacturer: National Semiconductor; PackageTopMarking: A01B*XTT; PowerWise: N; CompType: Amplifiers; High-Reliability: Y; DatasheetVersion: Jun-2006; PackageVersion: revD, Aug-2008; PackageReference: MF05A; PackageDescription: Molded SOT-23, .115 x .063 x .040 in Body, 5 Lead, .0375 in Pitch; PartNumber: LMC7111BIM5; RoHS: N; PinCount: 5; ComponentLink1Description: Manufacturer URL; ComponentLink1URL: http://www.national.com/; ComponentLink2Description: LMC7111 Datasheet; ComponentLink2URL: http://www.national.com/ds/LM/LMC7111.pdf; ComponentLink3Description: LMC7111 Web Page; ComponentLink3URL: http://www.national.com/pf/LM/LMC7111.html; ComponentLink4Description: MF05A Package Page; ComponentLink4URL: http://www.national.com/packaging/folders/mf05a.html
R?#1 R?#2 = RES 0402: PartNumber: *; Tolerance: *

## Sheet Actuator.SchDoc: Set in Document Options » Parameters » Title
size Tabloid; Author: Set in Document Options » Parameters » Author + Contact info
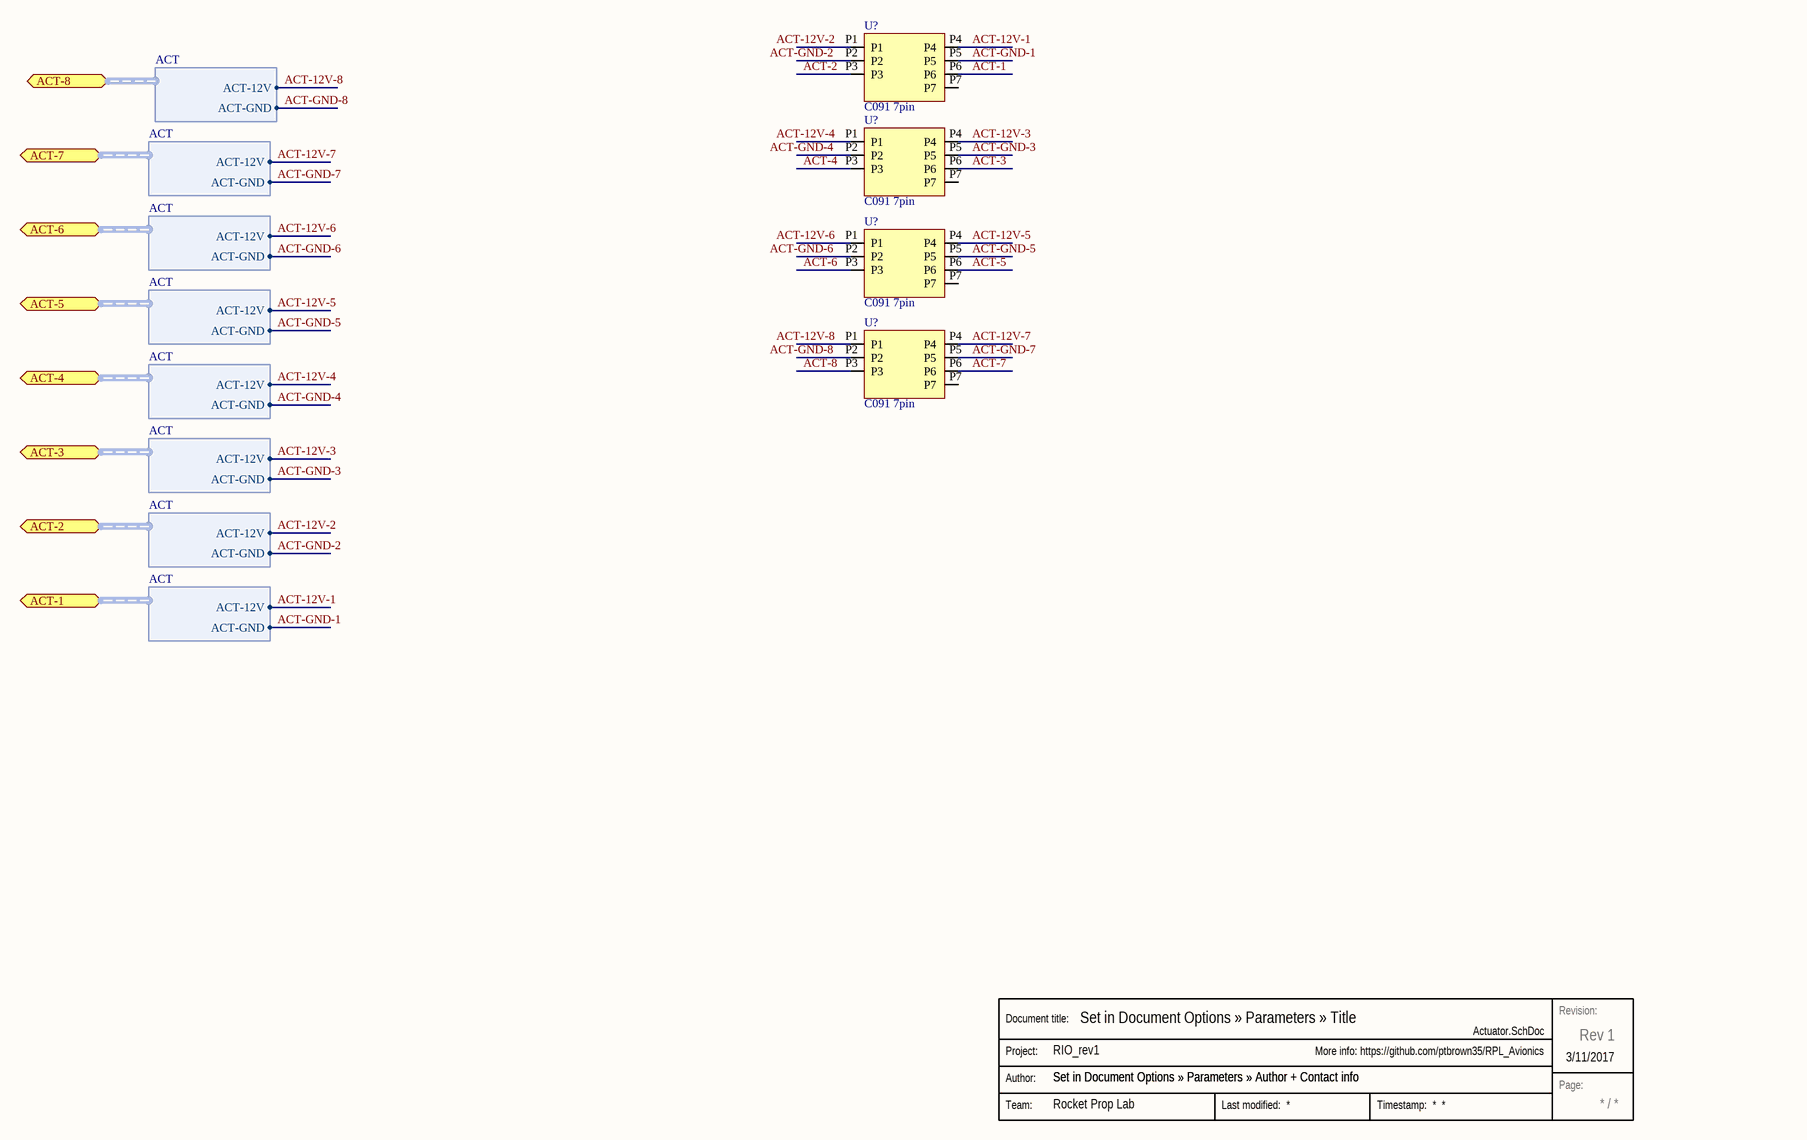
[diagram p8: Actuator.SchDoc]

### Parts
(Parts that share a designator on the sheet are numbered #1, #2 ... from top to bottom, then left to right.)
Stamp#7  Stamp  (value not drawn)  (graphical)
U?#5  C091 7pin
U?#6  C091 7pin
U?#7  C091 7pin
U?#8  C091 7pin

### Ports
ACT-1 (harness ACT), ACT-2 (harness ACT), ACT-3 (harness ACT), ACT-4 (harness ACT), ACT-5 (harness ACT), ACT-6 (harness ACT), ACT-7 (harness ACT), ACT-8 (harness ACT)

### Harnesses
ACT: ACT-GND, ACT-12V

### Nets
ACT-1: U?#5.P6
ACT-2: U?#5.P3
ACT-3: U?#6.P6
ACT-4: U?#6.P3
ACT-5: U?#7.P6
ACT-6: U?#7.P3
ACT-7: U?#8.P6
ACT-8: U?#8.P3
ACT-12V-1: U?#5.P4 ; port ACT-1.ACT-12V
ACT-12V-2: port ACT-2.ACT-12V
ACT-12V-3: U?#6.P4 ; port ACT-3.ACT-12V
ACT-12V-4: port ACT-4.ACT-12V
ACT-12V-5: U?#7.P4 ; port ACT-5.ACT-12V
ACT-12V-6: port ACT-6.ACT-12V
ACT-12V-7: U?#8.P4 ; port ACT-7.ACT-12V
ACT-12V-8: port ACT-8.ACT-12V
ACT-GND-1: U?#5.P5 ; port ACT-1.ACT-GND
ACT-GND-2: port ACT-2.ACT-GND
ACT-GND-3: U?#6.P5 ; port ACT-3.ACT-GND
ACT-GND-4: port ACT-4.ACT-GND
ACT-GND-5: U?#7.P5 ; port ACT-5.ACT-GND
ACT-GND-6: port ACT-6.ACT-GND
ACT-GND-7: U?#8.P5 ; port ACT-7.ACT-GND
ACT-GND-8: port ACT-8.ACT-GND

Not connected (* = marked no-connect by the designer): U?#5 P1 P2 P7; U?#6 P1 P2 P7; U?#7 P1 P2 P7; U?#8 P1 P2 P7

### Notes on the sheet
- Labels drawn without touching a wire or pin: ACT-12V-2, ACT-12V-4, ACT-12V-6, ACT-12V-8, ACT-GND-2, ACT-GND-4, ACT-GND-6, ACT-GND-8
- (in symbol Stamp) Revision:; Document title:; Project:; Author:; Page:; Team:

### Library data of the parts
U?#5-U?#8 = 7 pin connector

## Sheet EEPROM.SchDoc: Onboard Pressure/Temperature Sensor
size Tabloid; Author: Set in Document Options » Parameters » Author + Contact info
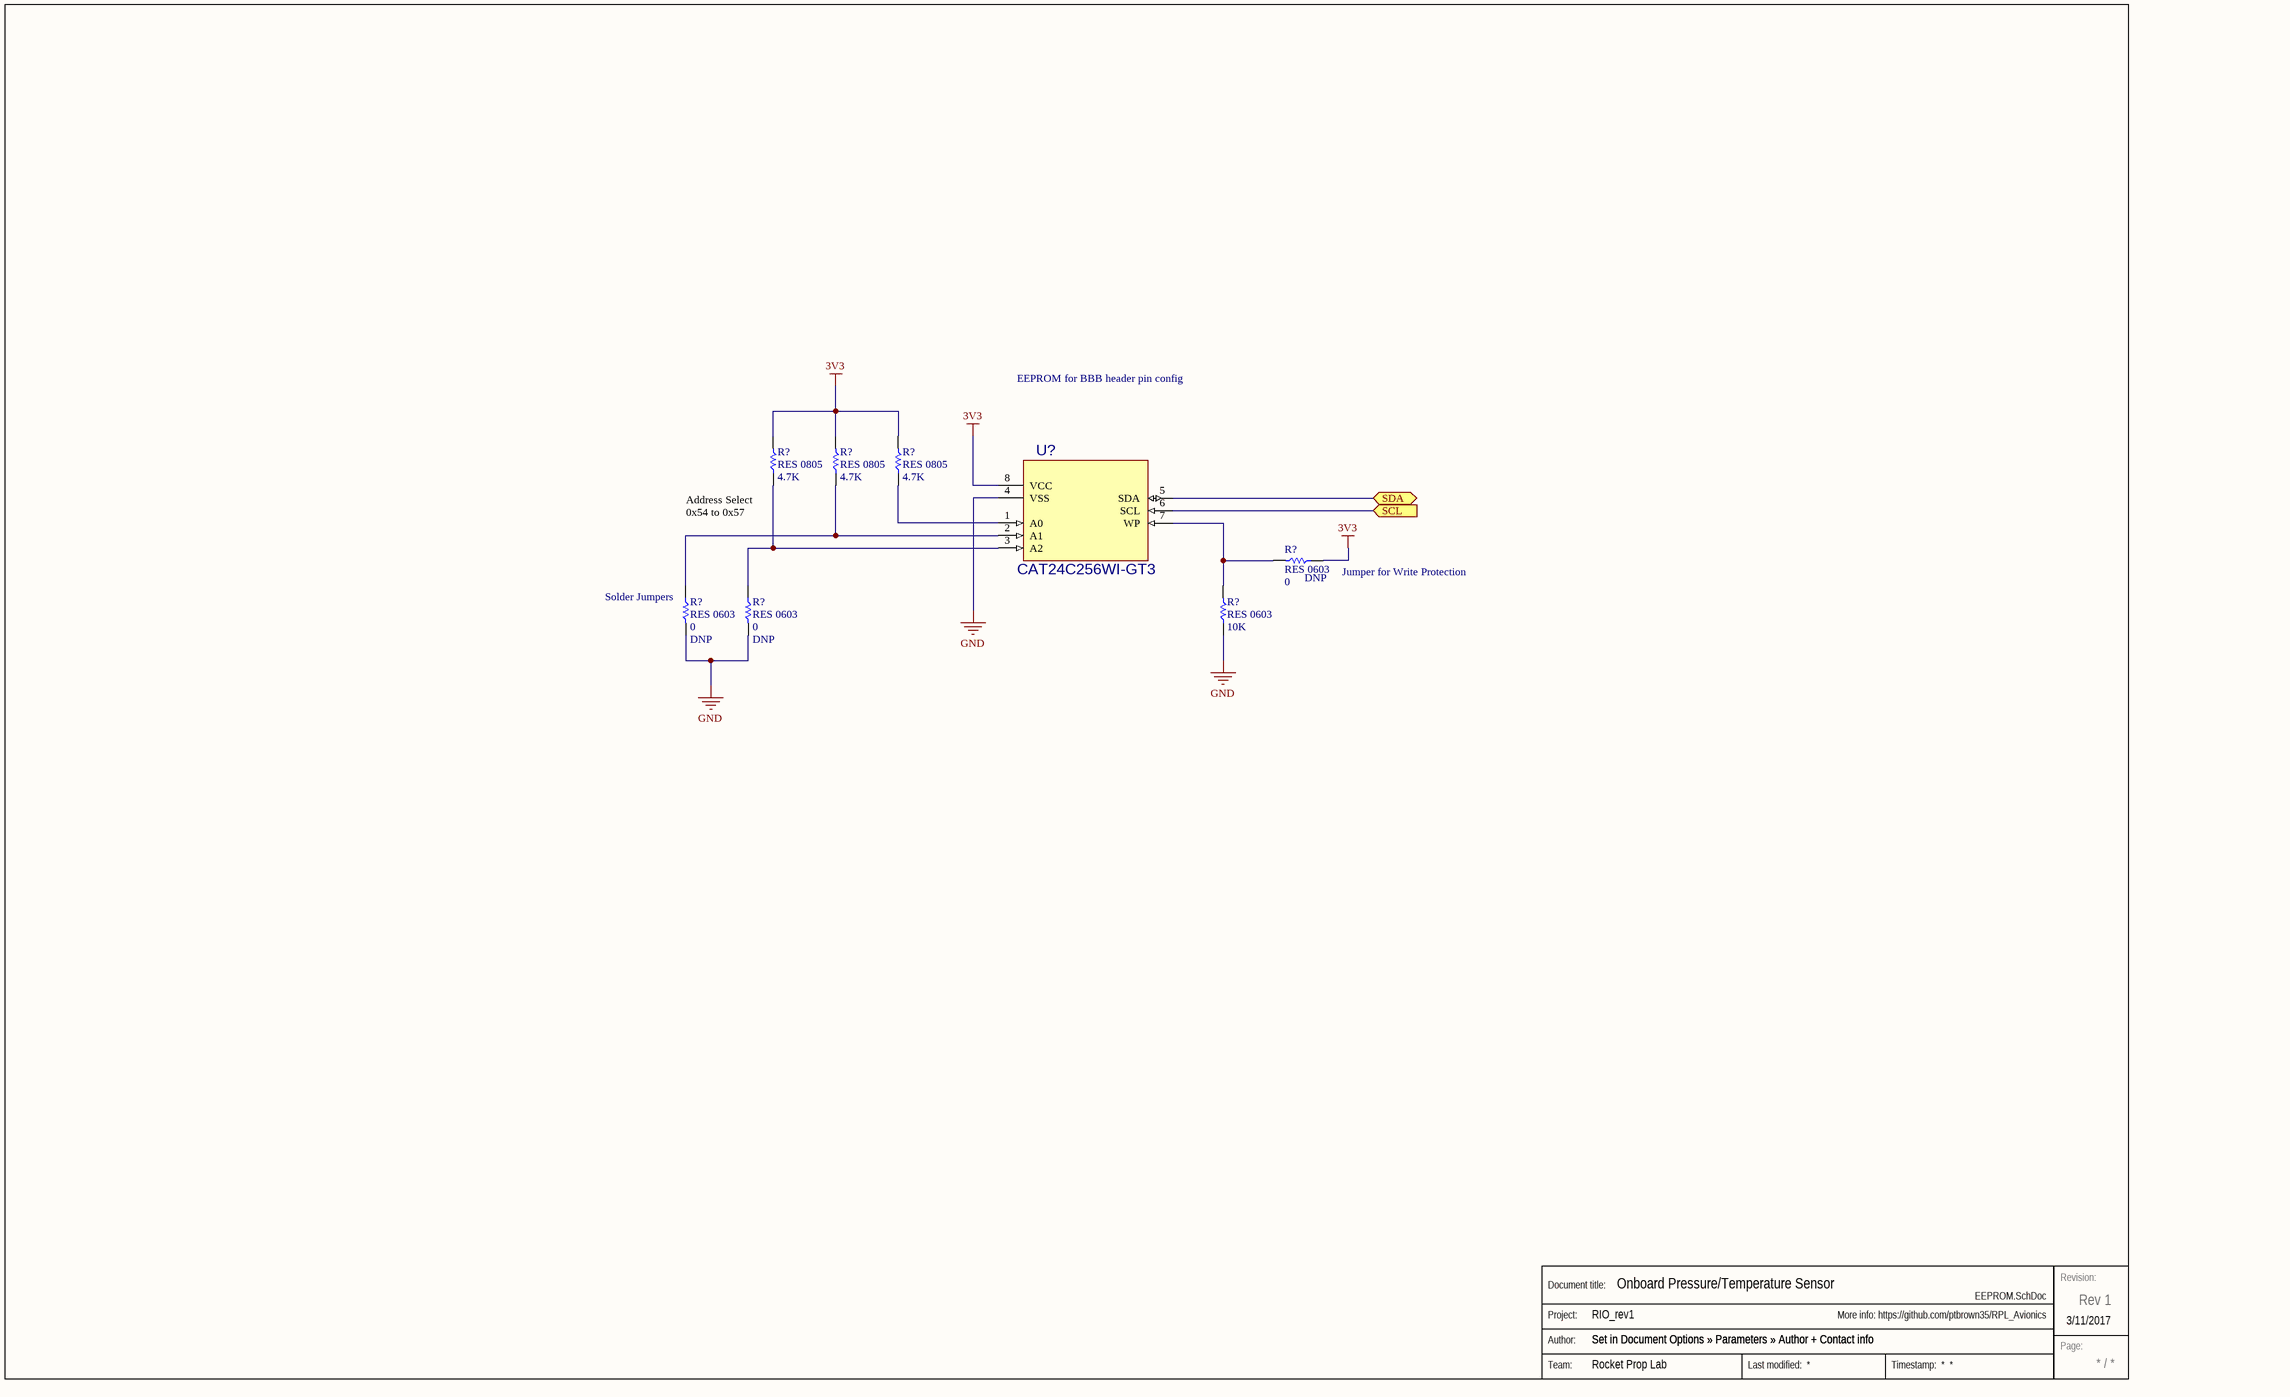
[diagram p9: EEPROM.SchDoc]

### Parts
(Parts that share a designator on the sheet are numbered #1, #2 ... from top to bottom, then left to right.)
R?#3  RES 0805  Value (Ohms): 4.7K  [RES 0805]
R?#4  RES 0805  Value (Ohms): 4.7K  [RES 0805]
R?#5  RES 0805  Value (Ohms): 4.7K  [RES 0805]
R?#6  RES 0603  Value (Ohms): 0  Do Not Place: DNP  [RES 0603]
R?#7  RES 0603  Value (Ohms): 10K  [RES 0603]
R?#8  RES 0603  Value (Ohms): 0  Do Not Place: DNP  [RES 0603]
R?#9  RES 0603  Value (Ohms): 0  Do Not Place: DNP  [RES 0603]
Stamp#8  Stamp  (value not drawn)  (graphical)
U?#9  CAT24C256WI-GT3  [SOIC127P600X175-8N]

### Ports
SCL (in), SDA (bidir)

### Nets
3V3: R?#3.1 R?#4.1 R?#5.1 R?#6.2 U?#9.8(VCC)  [project net PT-VCC]
GND: R?#7.2 R?#8.1 R?#9.1 U?#9.4(VSS)
NetR?#3_2: R?#3.2 R?#9.2 U?#9.3(A2)
NetR?#4_2: R?#4.2 R?#8.2 U?#9.2(A1)
NetR?#5_2: R?#5.2 U?#9.1(A0)
NetR?#6_1: R?#6.1 R?#7.1 U?#9.7(WP)
NetU?#9_5: U?#9.5(SDA) ; port SDA
NetU?#9_6: U?#9.6(SCL) ; port SCL

### Notes on the sheet
- EEPROM for BBB header pin config
- (near R?#3) Address Select
  0x54 to 0x57
- (near R?#6) Jumper for Write Protection
- (near R?#8) Solder Jumpers
- (in symbol Stamp) Revision:; Document title:; Project:; Author:; Page:; Team:

### Library data of the parts
U?#9 = CAT24C256WI-GT3: CAT24C256 Series 256 kbit %2832 K x 8%29 1.8 V I2C CMOS Serial EEPROM - SOIC-8; MF: ON Semiconductor; MP: CAT24C256WI-GT3; Price: 0.32 USD; Package: SOIC-8 ON Semiconductor; Availability: Good; Value: *; Mouser: http://www.mouser.com/ProductDetail/ON-Semiconductor/CAT24C256WI-GT3/?qs=sGAEpiMZZMuVhdAcoizlReWCLrywymY2%2fLYsR6sjnIQ%3d
R?#3-R?#5 = RES 0805: PartNumber: *; Tolerance: *
R?#6-R?#9 = RES 0603: PartNumber: *; Tolerance: *

## Nets that join several sheets
GND: U_Connectors/J-PT1 (J-PT_J-PT1.3), U_Connectors/J-PT2 (J-PT_J-PT2.3), U_Connectors/J-PT3 (J-PT_J-PT3.3), U_Connectors/J-PT4 (J-PT_J-PT4.3), U_Connectors/J-PT5 (J-PT_J-PT5.3), U_Connectors/J-PT6 (J-PT_J-PT6.3), U_Connectors/J-PT7 (J-PT_J-PT7.3), U_Connectors/J-PT8 (J-PT_J-PT8.3), PowerManagement (5 pins), U_PTSignals/U_ADC1 (R?_U_ADC1#2.1 U?_U_ADC1.5), U_PTSignals/U_ADC2 (R?_U_ADC2#2.1 U?_U_ADC2.5), U_PTSignals/U_ADC3 (R?_U_ADC3#2.1 U?_U_ADC3.5), U_PTSignals/U_ADC4 (R?_U_ADC4#2.1 U?_U_ADC4.5), U_PTSignals/U_ADC5 (R?_U_ADC5#2.1 U?_U_ADC5.5), U_PTSignals/U_ADC6 (R?_U_ADC6#2.1 U?_U_ADC6.5), U_PTSignals/U_ADC7 (R?_U_ADC7#2.1 U?_U_ADC7.5), U_PTSignals/U_ADC8 (R?_U_ADC8#2.1 U?_U_ADC8.5), ADC (R?_ADC#2.1 U?_ADC.5), EEPROM (R?#7.2 R?#8.1 R?#9.1 U?#9.4)
PT-VCC: U_Connectors/J-PT1 (J-PT_J-PT1.1), U_Connectors/J-PT2 (J-PT_J-PT2.1), U_Connectors/J-PT3 (J-PT_J-PT3.1), U_Connectors/J-PT4 (J-PT_J-PT4.1), U_Connectors/J-PT5 (J-PT_J-PT5.1), U_Connectors/J-PT6 (J-PT_J-PT6.1), U_Connectors/J-PT7 (J-PT_J-PT7.1), U_Connectors/J-PT8 (J-PT_J-PT8.1), PowerManagement (C?#2.2 U?#2.1 U?#2.6), U_PTSignals/U_ADC1 (U?_U_ADC1.2), U_PTSignals/U_ADC2 (U?_U_ADC2.2), U_PTSignals/U_ADC3 (U?_U_ADC3.2), U_PTSignals/U_ADC4 (U?_U_ADC4.2), U_PTSignals/U_ADC5 (U?_U_ADC5.2), U_PTSignals/U_ADC6 (U?_U_ADC6.2), U_PTSignals/U_ADC7 (U?_U_ADC7.2), U_PTSignals/U_ADC8 (U?_U_ADC8.2), ADC (U?_ADC.2), EEPROM (5 pins)
PT-SIG: U_Connectors/J-PT1 (J-PT_J-PT1.2), U_Connectors/J-PT2 (J-PT_J-PT2.2), U_Connectors/J-PT3 (J-PT_J-PT3.2), U_Connectors/J-PT4 (J-PT_J-PT4.2), U_Connectors/J-PT5 (J-PT_J-PT5.2), U_Connectors/J-PT6 (J-PT_J-PT6.2), U_Connectors/J-PT7 (J-PT_J-PT7.2), U_Connectors/J-PT8 (J-PT_J-PT8.2)